# Altium project zxRevo rev2.5.PrjPcb (part 1 of 3)
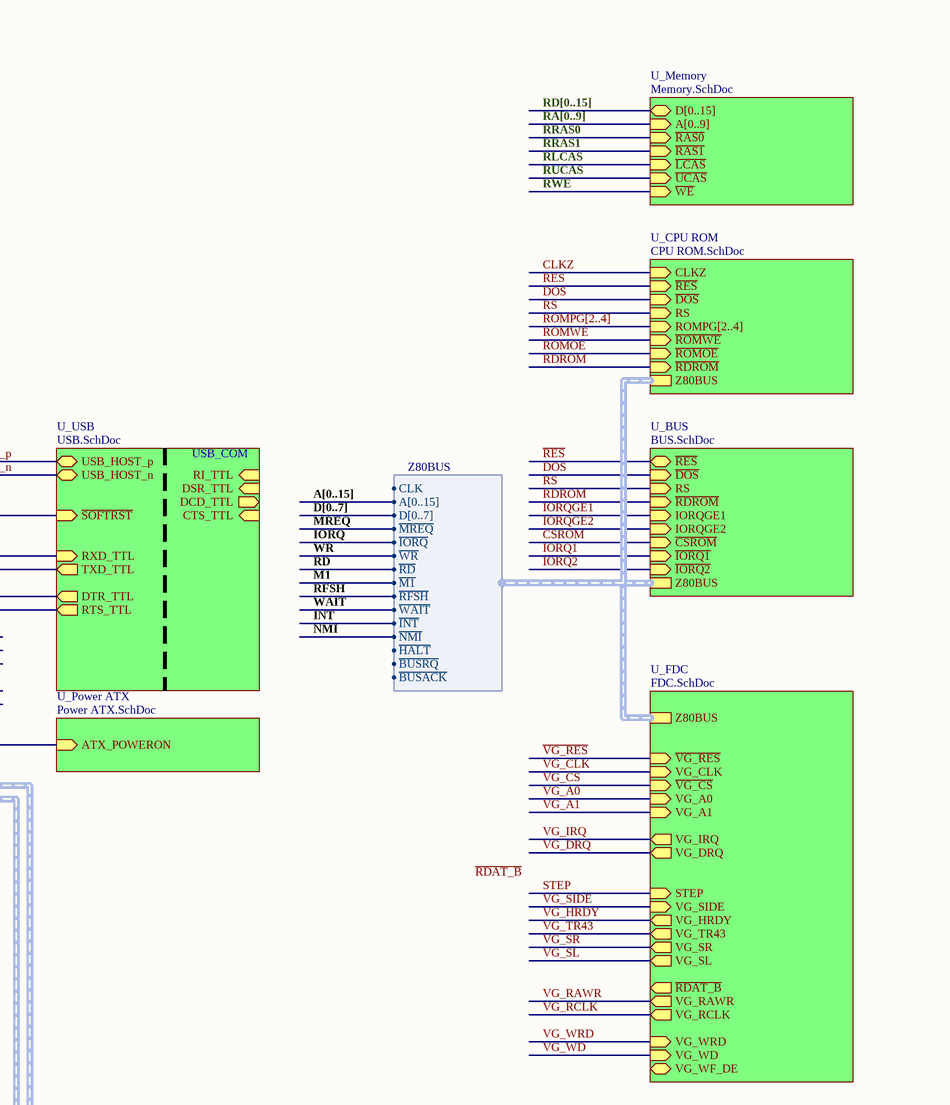
[diagram p0: TOP.SchDoc, top right]
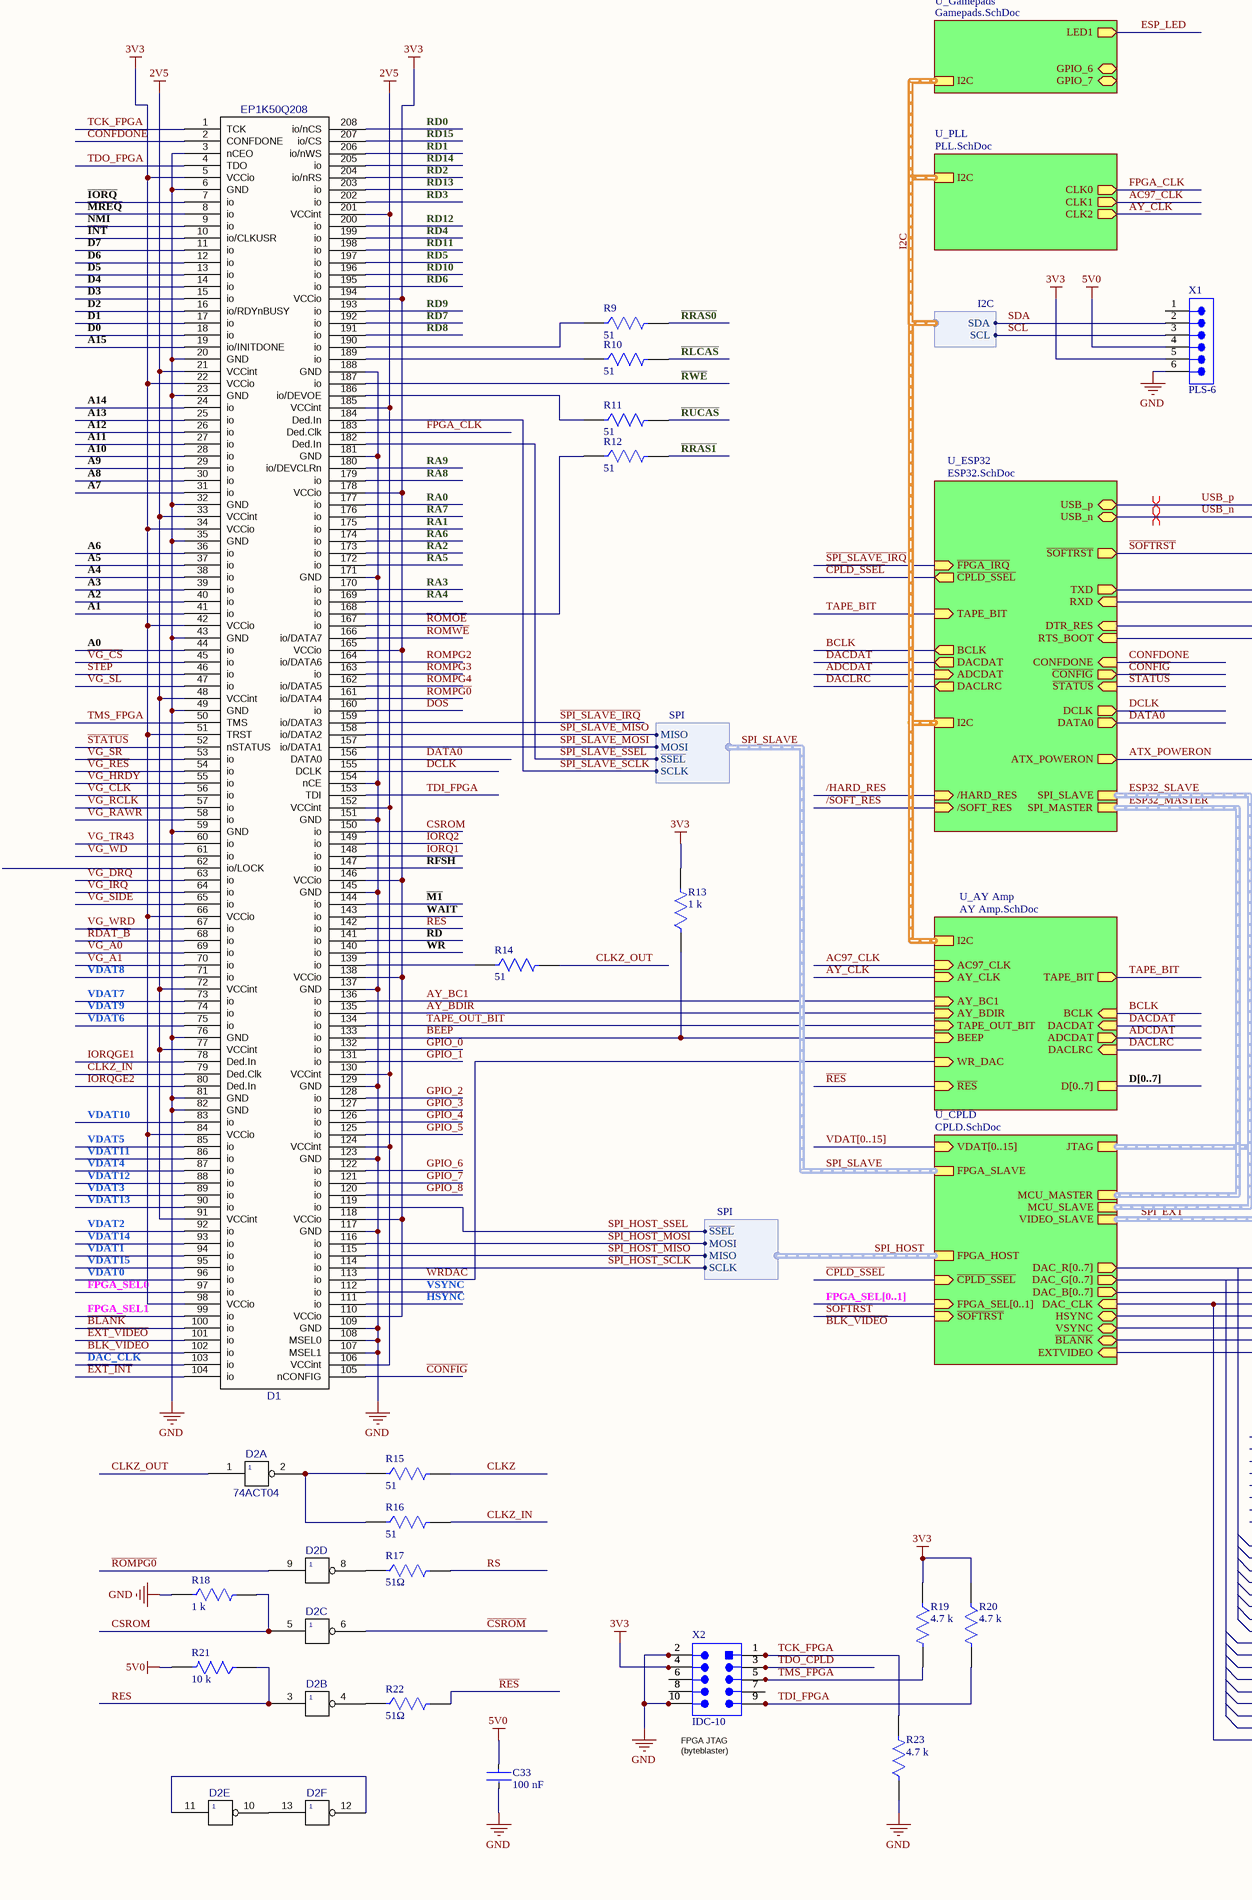
[diagram p1: TOP.SchDoc, bottom left]
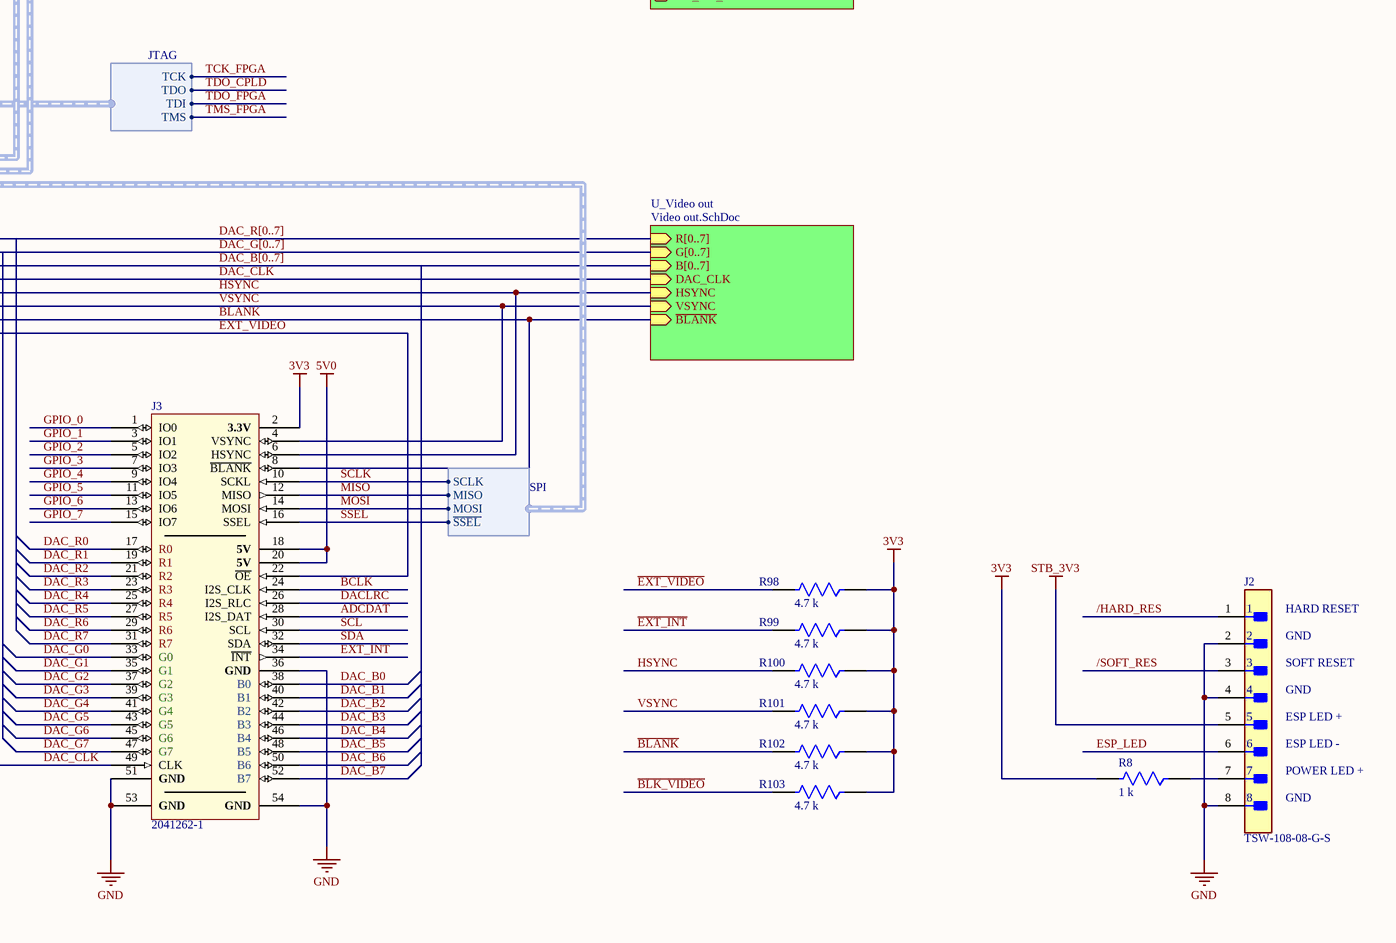
[diagram p2: TOP.SchDoc, bottom right]
16 sheets, 318 parts. Net scope: hierarchical (ports join the sheet entries above them; power ports are global).
Board file: RevA2.PcbDoc
Sheets:
  TOP.SchDoc
    U_Memory = Memory.SchDoc
    U_CPU ROM = CPU ROM.SchDoc
    U_BUS = BUS.SchDoc
    U_FDC = FDC.SchDoc
    U_CPLD = CPLD.SchDoc
      U_SDCARD = SDCARD.SchDoc
    U_Power ATX = Power ATX.SchDoc
    U_USB = USB.SchDoc
    U_ESP32 = ESP32.SchDoc
    U_AY Amp = AY Amp.SchDoc
      U_Tape = Tape.SchDoc
    U_PLL = PLL.SchDoc
    U_Gamepads = Gamepads.SchDoc
    U_Video out = Video out.SchDoc
  Sheet1.SchDoc

## Sheet TOP.SchDoc
size A1; SheetNumber: 1; SheetTotal: 16

### Parts
C33  Capacitance: 100 nF  [CC0805]  (hidden comment: CC0805-1.5pF)
D1  EP1K50Q208  [PQFP208X5]
D2  value 74ACT04  [SO14]  (hidden comment: 04)  (parts A,B,C,D,E,F of 6)
J2  TSW-108-08-G-S  [FP-TSW-108-08-G-S-MFG]
J3  2041262-1  [FP-2041262-1-0]
R8  Resistance: 1 k  [CR0805]  (hidden comment: CR0805-51)
R9  Resistance: 51  [CR0805]  (hidden comment: CR0805-51)
R10  Resistance: 51  [CR0805]  (hidden comment: CR0805-51)
R11  Resistance: 51  [CR0805]  (hidden comment: CR0805-51)
R12  Resistance: 51  [CR0805]  (hidden comment: CR0805-51)
R13  Resistance: 1 k  [CR0805]  (hidden comment: CR0805-51)
R14  Resistance: 51  [CR0805]  (hidden comment: CR0805-51)
R15  Resistance: 51  [CR0805]  (hidden comment: CR0805-51)
R16  Resistance: 51  [CR0805]  (hidden comment: CR0805-51)
R17  value 51Ω  [CR0805]  (hidden comment: CR0805-51)
R18  Resistance: 1 k  [CR0805]  (hidden comment: CR0805-51)
R19  Resistance: 4.7 k  [CR0805]  (hidden comment: CR0805-51)
R20  Resistance: 4.7 k  [CR0805]  (hidden comment: CR0805-51)
R21  Resistance: 10 k  [CR0805]  (hidden comment: CR0805-51)
R22  value 51Ω  [CR0805]  (hidden comment: CR0805-51)
R23  Resistance: 4.7 k  [CR0805]  (hidden comment: CR0805-51)
R98  Resistance: 4.7 k  [CR0805]  (hidden comment: CR0805-51)
R99  Resistance: 4.7 k  [CR0805]  (hidden comment: CR0805-51)
R100  Resistance: 4.7 k  [CR0805]  (hidden comment: CR0805-51)
R101  Resistance: 4.7 k  [CR0805]  (hidden comment: CR0805-51)
R102  Resistance: 4.7 k  [CR0805]  (hidden comment: CR0805-51)
R103  Resistance: 4.7 k  [CR0805]  (hidden comment: CR0805-51)
X1  PLS-6  [SMTC-TSW-106-07-X-S]
X2  IDC-10  [BH-10]

### Sub-sheets
U_AY Amp = AY Amp.SchDoc: AY_BC1 (in), ~{RES} (in), AY_CLK (in), AY_BDIR (in), I2C (harness I2C), DACDAT (in), TAPE_BIT (out), ADCDAT (out), BCLK (in), BEEP (in), DACLRC (in), WR_DAC (in), D[0..7], AC97_CLK (in), TAPE_OUT_BIT (in)
U_BUS = BUS.SchDoc: ~{RES} (bidir), ~{DOS} (in), RS (in), ~{RDROM} (in), IORQGE1 (in), IORQGE2 (in), ~{CSROM} (in), ~{IORQ1} (in), ~{IORQ2} (in), Z80BUS (harness Z80BUS)
U_CPLD = CPLD.SchDoc: VDAT[0..15] (in), VSYNC (bidir), HSYNC (bidir), DAC_CLK (in), FPGA_HOST (harness SPI), FPGA_SLAVE (harness SPI), MCU_MASTER (harness JTAG), MCU_SLAVE (harness SPI), FPGA_SEL[0..1] (in), JTAG (harness JTAG), ~{SOFTRST} (in), ~{CPLD_SSEL} (in), DAC_G[0..7] (out), DAC_B[0..7] (out), DAC_R[0..7] (out), EXTVIDEO (in), ~{BLANK} (bidir), VIDEO_SLAVE (harness SPI)
U_CPU ROM = CPU ROM.SchDoc: CLKZ (in), ~{RES} (in), ~{DOS} (in), RS (in), ROMPG[2..4] (in), ~{ROMWE} (in), ~{ROMOE} (in), ~{RDROM} (in), Z80BUS (harness Z80BUS)
U_ESP32 = ESP32.SchDoc: SPI_SLAVE (harness SPI), TXD (out), RXD (in), DTR_RES (in), RTS_BOOT (in), I2C (harness I2C), TAPE_BIT (in), USB_n (bidir), USB_p (bidir), SPI_MASTER (harness SPI), ~{SOFTRST} (out), ATX_POWERON (out), ~{FPGA_IRQ} (in), DCLK (out), DATA0 (out), ~{STATUS} (in), CONFDONE (in), ~{CONFIG} (out), ~{CPLD_SSEL} (out), DACLRC (out), ADCDAT (in), BCLK (out), DACDAT (out), /HARD_RES (in), /SOFT_RES (in)
U_FDC = FDC.SchDoc: VG_CLK (in), VG_IRQ (out), VG_DRQ (out), ~{VG_CS} (in), VG_SIDE (in), STEP (in), VG_A0 (in), VG_A1 (in), VG_TR43 (out), VG_SR (out), VG_SL (out), VG_WD (in), VG_WRD (in), VG_WF_DE (bidir), VG_RAWR (out), VG_RCLK (out), ~{VG_RES} (in), VG_HRDY (out), Z80BUS (harness Z80BUS), ~{RDAT_B} (out)
U_Gamepads = Gamepads.SchDoc: GPIO_7 (bidir), LED1 (out), GPIO_6 (bidir), I2C (harness I2C)
U_Memory = Memory.SchDoc: D[0..15] (bidir), A[0..9] (in), ~{RAS0} (in), ~{RAS1} (in), ~{LCAS} (in), ~{UCAS} (in), ~{WE} (in)
U_PLL = PLL.SchDoc: CLK0 (out), CLK1 (out), CLK2 (out), I2C (harness I2C)
U_Power ATX = Power ATX.SchDoc: ATX_POWERON (in)
U_USB = USB.SchDoc: RXD_TTL (in), USB_HOST_p (bidir), TXD_TTL (out), RTS_TTL (out), CTS_TTL (in), DCD_TTL (out), DSR_TTL (in), USB_HOST_n (bidir), RI_TTL (in), DTR_TTL (out), ~{SOFTRST} (in)
U_Video out = Video out.SchDoc: R[0..7] (in), G[0..7] (in), B[0..7] (in), DAC_CLK (in), HSYNC (in), VSYNC (in), ~{BLANK} (in)

### Harnesses
SPI: ~{SSEL}, SCLK, MOSI, MISO
JTAG: TCK, TDO, TDI, TMS
I2C: SDA, SCL
Z80BUS: A[0..15], D[0..7], ~{MREQ}, ~{IORQ}, ~{WR}, ~{RD}, ~{M1}, ~{RFSH}, ~{WAIT}, ~{INT}, ~{NMI}, ~{HALT}, ~{BUSRQ}, ~{BUSACK}, CLK

### Nets
2V5: D1.21(VCCint) D1.33(VCCint) D1.48(VCCint) D1.72(VCCint) D1.77(VCCint) D1.91(VCCint) D1.106(VCCint) D1.124(VCCint) D1.130(VCCint) D1.152(VCCint) D1.185(VCCint) D1.201(VCCint)
3V3: D1.5(VCCio) D1.22(VCCio) D1.34(VCCio) D1.42(VCCio) D1.51(TRST) D1.66(VCCio) D1.84(VCCio) D1.98(VCCio) D1.110(VCCio) D1.118(VCCio) D1.138(VCCio) D1.146(VCCio) D1.165(VCCio) D1.178(VCCio) D1.194(VCCio) J3.2(3.3V) R8.2 R13.2 R19.1 R20.1 R98.1 R99.1 R100.1 R101.1 R102.1 R103.1 X1.5 X2.4
5V0: C33.1 D2.14(+5v) J3.18(5V) J3.20(5V) R21.2 X1.4  [also labelled VCC5]
GND: C33.2 D1.3(nCEO) D1.6(GND) D1.20(GND) D1.23(GND) D1.32(GND) D1.35(GND) D1.43(GND) D1.49(GND) D1.59(GND) D1.76(GND) D1.81(GND) D1.82(GND) D1.107(MSEL1) D1.108(MSEL0) D1.109(GND) D1.117(GND) D1.123(GND) D1.129(GND) D1.137(GND) D1.145(GND) D1.151(GND) D1.154(nCE) D1.171(GND) D1.181(GND) D1.188(GND) D2.7(GND) J2.2 J2.4 J2.8 J3.36(GND) J3.51(GND) J3.53(GND) J3.54(GND) R18.1 R23.1 X1.6 X2.2 X2.10
STB_3V3: J2.5
/HARD_RES: J2.1 ; sheet U_ESP32//HARD_RES
/SOFT_RES: J2.3 ; sheet U_ESP32//SOFT_RES
A0: D1.44(io)
A1: D1.41(io)
A2: D1.40(io)
A3: D1.39(io)
A4: D1.38(io)
A5: D1.37(io)
A6: D1.36(io)
A7: D1.31(io)
A8: D1.30(io)
A9: D1.29(io)
A10: D1.28(io)
A11: D1.27(io)
A12: D1.26(io)
A13: D1.25(io)
A14: D1.24(io)
A15: D1.19(io/INITDONE)
AC97_CLK: sheet U_AY Amp/AC97_CLK, sheet U_PLL/CLK1
ADCDAT: J3.28(I2S_DAT) ; sheet U_ESP32/ADCDAT, sheet U_AY Amp/ADCDAT
ATX_POWERON: sheet U_Power ATX/ATX_POWERON, sheet U_ESP32/ATX_POWERON
AY_BC1: D1.136(io) ; sheet U_AY Amp/AY_BC1
AY_BDIR: D1.135(io) ; sheet U_AY Amp/AY_BDIR
AY_CLK: sheet U_AY Amp/AY_CLK, sheet U_PLL/CLK2
~{BLANK}: D1.100(io) J3.8(~{BLANK}) R102.2 ; sheet U_CPLD/~{BLANK}, sheet U_Video out/~{BLANK}
~{BLK_VIDEO}: D1.102(io) R103.2  [project net ~{BLK_VIDEO}_1]
BCLK: J3.24(I2S_CLK) ; sheet U_ESP32/BCLK, sheet U_AY Amp/BCLK
BEEP: D1.133(io) R13.1 ; sheet U_AY Amp/BEEP
~{CONFIG}: D1.105(nCONFIG) ; sheet U_ESP32/~{CONFIG}
~{CPLD_SSEL}: sheet U_CPLD/~{CPLD_SSEL}, sheet U_ESP32/~{CPLD_SSEL}
~{CSROM}: D2.6 ; sheet U_BUS/~{CSROM}
CLKZ: R15.2 ; sheet U_CPU ROM/CLKZ
CLKZ_IN: D1.79(Ded.Clk) R16.2  [project net CLKZ_IN_1]
CLKZ_OUT: D2.1 R14.2  [project net CLKZ_OUT_1]
CONFDONE: D1.2(CONFDONE) ; sheet U_ESP32/CONFDONE
CSROM: D1.150(io) D2.5 R18.2  [project net CSROM_1]
D0: D1.18(io)
D1: D1.17(io)
D2: D1.16(io/RDYnBUSY)
D3: D1.15(io)
D4: D1.14(io)
D5: D1.13(io)
D6: D1.12(io)
D7: D1.11(io)
~{DOS}: D1.160(io) ; sheet U_CPU ROM/~{DOS}, sheet U_BUS/~{DOS}
DAC_B0: J3.38(B0)
DAC_B1: J3.40(B1)
DAC_B2: J3.42(B2)
DAC_B3: J3.44(B3)
DAC_B4: J3.46(B4)
DAC_B5: J3.48(B5)
DAC_B6: J3.50(B6)
DAC_B7: J3.52(B7)
DAC_CLK: D1.103(io) J3.49(CLK) ; sheet U_CPLD/DAC_CLK, sheet U_Video out/DAC_CLK
DAC_G0: J3.33(G0)
DAC_G1: J3.35(G1)
DAC_G2: J3.37(G2)
DAC_G3: J3.39(G3)
DAC_G4: J3.41(G4)
DAC_G5: J3.43(G5)
DAC_G6: J3.45(G6)
DAC_G7: J3.47(G7)
DAC_R0: J3.17(R0)
DAC_R1: J3.19(R1)
DAC_R2: J3.21(R2)
DAC_R3: J3.23(R3)
DAC_R4: J3.25(R4)
DAC_R5: J3.27(R5)
DAC_R6: J3.29(R6)
DAC_R7: J3.31(R7)
DACDAT: sheet U_ESP32/DACDAT, sheet U_AY Amp/DACDAT
DACLRC: J3.26(I2S_RLC) ; sheet U_ESP32/DACLRC, sheet U_AY Amp/DACLRC
DATA0: D1.156(DATA0) ; sheet U_ESP32/DATA0
DCLK: D1.155(DCLK) ; sheet U_ESP32/DCLK
DTR: sheet U_USB/DTR_TTL, sheet U_ESP32/DTR_RES
~{EXT_INT}: D1.104(io) J3.34(~{INT}) R99.2  [project net ~{EXT_INT}_1]
~{EXT_VIDEO}: D1.101(io) J3.22(~{OE}) R98.2 ; sheet U_CPLD/EXTVIDEO
ESP32_RXD: sheet U_USB/TXD_TTL, sheet U_ESP32/RXD
ESP32_TXD: sheet U_USB/RXD_TTL, sheet U_ESP32/TXD
ESP_LED: J2.6 ; sheet U_Gamepads/LED1
FPGA_CLK: D1.183(Ded.Clk) ; sheet U_PLL/CLK0
FPGA_SEL0: D1.97(io)
FPGA_SEL1: D1.99(io)
GPIO_0: D1.132(io) J3.1(IO0)  [project net GPIO_0_1]
GPIO_1: D1.131(io) J3.3(IO1)  [project net GPIO_1_1]
GPIO_2: D1.128(io) J3.5(IO2)  [project net GPIO_2_1]
GPIO_3: D1.127(io) J3.7(IO3)  [project net GPIO_3_1]
GPIO_4: D1.126(io) J3.9(IO4)  [project net GPIO_4_1]
GPIO_5: D1.125(io) J3.11(IO5)  [project net GPIO_5_1]
GPIO_6: D1.122(io) J3.13(IO6)  [project net GPIO_6_1]
GPIO_7: D1.121(io) J3.15(IO7)  [project net GPIO_7_1]
GPIO_8: D1.120(io)  [project net GPIO_8_1]
HSYNC: D1.111(io) J3.6(HSYNC) R100.2 ; sheet U_CPLD/HSYNC, sheet U_Video out/HSYNC
~{INT}: D1.10(io/CLKUSR) ; sheet U_CPU ROM/Z80BUS.~{INT}
~{IORQ}: D1.7(io) ; sheet U_CPU ROM/Z80BUS.~{IORQ}
~{IORQ1}: D1.148(io) ; sheet U_BUS/~{IORQ1}
~{IORQ2}: D1.149(io) ; sheet U_BUS/~{IORQ2}
IORQGE1: D1.78(Ded.In) ; sheet U_BUS/IORQGE1
IORQGE2: D1.80(Ded.In) ; sheet U_BUS/IORQGE2
~{M1}: D1.144(io) ; sheet U_CPU ROM/Z80BUS.~{M1}
~{MREQ}: D1.8(io) ; sheet U_CPU ROM/Z80BUS.~{MREQ}
MISO: J3.12(MISO) ; sheet U_CPLD/VIDEO_SLAVE.MISO
MOSI: J3.14(MOSI) ; sheet U_CPLD/VIDEO_SLAVE.MOSI
~{NMI}: D1.9(io) ; sheet U_CPU ROM/Z80BUS.~{NMI}
~{RD}: D1.141(io) ; sheet U_CPU ROM/Z80BUS.~{RD}
~{RDAT_B}: D1.68(io)  [project net ~{RDAT_B}_1]
~{RDROM}: sheet U_CPU ROM/~{RDROM}, sheet U_BUS/~{RDROM}
~{RES}: R22.2 ; sheet U_CPU ROM/~{RES}, sheet U_BUS/~{RES}, sheet U_AY Amp/~{RES}
~{RFSH}: D1.147(io) ; sheet U_CPU ROM/Z80BUS.~{RFSH}
~{RLCAS}: R10.2 ; sheet U_Memory/~{LCAS}
~{ROMOE}: D1.167(io) ; sheet U_CPU ROM/~{ROMOE}
~{ROMPG0}: D1.161(io/DATA4) D2.9  [project net ~{ROMPG0}_1]
~{ROMWE}: D1.166(io/DATA7) ; sheet U_CPU ROM/~{ROMWE}
~{RRAS0}: R9.2 ; sheet U_Memory/~{RAS0}
~{RRAS1}: R12.2 ; sheet U_Memory/~{RAS1}
~{RUCAS}: R11.2 ; sheet U_Memory/~{UCAS}
~{RWE}: D1.187(io) ; sheet U_Memory/~{WE}
RA0: D1.177(io)
RA1: D1.175(io)
RA2: D1.173(io)
RA3: D1.170(io)
RA4: D1.169(io)
RA5: D1.172(io)
RA6: D1.174(io)
RA7: D1.176(io)
RA8: D1.179(io)
RA9: D1.180(io/DEVCLRn)
RD0: D1.208(io/nCS)
RD1: D1.206(io/nWS)
RD2: D1.204(io/nRS)
RD3: D1.202(io)
RD4: D1.199(io)
RD5: D1.197(io)
RD6: D1.195(io)
RD7: D1.192(io)
RD8: D1.191(io)
RD9: D1.193(io)
RD10: D1.196(io)
RD11: D1.198(io)
RD12: D1.200(io)
RD13: D1.203(io)
RD14: D1.205(io)
RD15: D1.207(io/CS)
RES: D1.142(io) D2.3 R21.1  [project net RES_1]
ROMPG2: D1.164(io/DATA6)
ROMPG3: D1.163(io)
ROMPG4: D1.162(io/DATA5)
RS: R17.2 ; sheet U_CPU ROM/RS, sheet U_BUS/RS
RTS: sheet U_USB/RTS_TTL, sheet U_ESP32/RTS_BOOT
~{SOFTRST}: sheet U_CPLD/~{SOFTRST}, sheet U_USB/~{SOFTRST}, sheet U_ESP32/~{SOFTRST}
~{SPI_SLAVE_IRQ}: D1.159(io/DATA3) ; sheet U_ESP32/~{FPGA_IRQ}
~{SPI_SLAVE_SSEL}: D1.182(Ded.In) ; sheet U_CPLD/FPGA_SLAVE.~{SSEL}
~{STATUS}: D1.52(nSTATUS) ; sheet U_ESP32/~{STATUS}
SCL: J3.30(SCL) X1.3 ; sheet U_ESP32/I2C.SCL  [project net I2C.SCL]
SCLK: J3.10(SCKL) ; sheet U_CPLD/VIDEO_SLAVE.SCLK
SDA: J3.32(SDA) X1.2 ; sheet U_ESP32/I2C.SDA  [project net I2C.SDA]
SPI_HOST_MISO: D1.115(io) ; sheet U_CPLD/FPGA_HOST.MISO  [project net SPI_HOST.MISO]
SPI_HOST_MOSI: D1.116(io) ; sheet U_CPLD/FPGA_HOST.MOSI  [project net SPI_HOST.MOSI]
SPI_HOST_SCLK: D1.114(io) ; sheet U_CPLD/FPGA_HOST.SCLK  [project net SPI_HOST.SCLK]
SPI_HOST_SSEL: D1.119(io) ; sheet U_CPLD/FPGA_HOST.~{SSEL}  [project net SPI_HOST.~{SSEL}]
SPI_SLAVE_MISO: D1.158(io/DATA2) ; sheet U_CPLD/FPGA_SLAVE.MISO  [project net SPI_SLAVE.MISO]
SPI_SLAVE_MOSI: D1.157(io/DATA1) ; sheet U_CPLD/FPGA_SLAVE.MOSI  [project net SPI_SLAVE.MOSI]
SPI_SLAVE_SCLK: D1.184(Ded.In) ; sheet U_CPLD/FPGA_SLAVE.SCLK  [project net SPI_SLAVE.SCLK]
SSEL: J3.16(SSEL) ; sheet U_CPLD/VIDEO_SLAVE.~{SSEL}  [project net SPI_EXT.~{SSEL}]
STEP: D1.46(io) ; sheet U_FDC/STEP
TAPE_BIT: sheet U_ESP32/TAPE_BIT, sheet U_AY Amp/TAPE_BIT
TAPE_OUT_BIT: D1.134(io) ; sheet U_AY Amp/TAPE_OUT_BIT
TCK_FPGA: D1.1(TCK) R23.2 X2.1 ; sheet U_CPLD/JTAG.TCK
TDI_FPGA: D1.153(TDI) R20.2 X2.9  [project net TDI_FPGA_1]
TDO_CPLD: X2.3 ; sheet U_CPLD/JTAG.TDO
TDO_FPGA: D1.4(TDO) ; sheet U_CPLD/JTAG.TDI
TMS_FPGA: D1.50(TMS) R19.2 X2.5 ; sheet U_CPLD/JTAG.TMS
USB_n: sheet U_USB/USB_HOST_n, sheet U_ESP32/USB_n
USB_p: sheet U_USB/USB_HOST_p, sheet U_ESP32/USB_p
~{VG_CS}: D1.45(io) ; sheet U_FDC/~{VG_CS}
~{VG_RES}: D1.54(io) ; sheet U_FDC/~{VG_RES}
VDAT0: D1.96(io)
VDAT1: D1.94(io)
VDAT2: D1.92(io)
VDAT3: D1.89(io)
VDAT4: D1.87(io)
VDAT5: D1.85(io)
VDAT6: D1.75(io)
VDAT7: D1.73(io)
VDAT8: D1.71(io)
VDAT9: D1.74(io)
VDAT10: D1.83(io)
VDAT11: D1.86(io)
VDAT12: D1.88(io)
VDAT13: D1.90(io)
VDAT14: D1.93(io)
VDAT15: D1.95(io)
VG_A0: D1.69(io) ; sheet U_FDC/VG_A0
VG_A1: D1.70(io) ; sheet U_FDC/VG_A1
VG_CLK: D1.56(io) ; sheet U_FDC/VG_CLK
VG_DRQ: D1.63(io) ; sheet U_FDC/VG_DRQ
VG_HRDY: D1.55(io) ; sheet U_FDC/VG_HRDY
VG_IRQ: D1.64(io) ; sheet U_FDC/VG_IRQ
VG_RAWR: D1.58(io) ; sheet U_FDC/VG_RAWR
VG_RCLK: D1.57(io) ; sheet U_FDC/VG_RCLK
VG_SIDE: D1.65(io) ; sheet U_FDC/VG_SIDE
VG_SL: D1.47(io) ; sheet U_FDC/VG_SL
VG_SR: D1.53(io) ; sheet U_FDC/VG_SR
VG_TR43: D1.60(io) ; sheet U_FDC/VG_TR43
VG_WD: D1.61(io) ; sheet U_FDC/VG_WD
VG_WRD: D1.67(io) ; sheet U_FDC/VG_WRD
VSYNC: D1.112(io) J3.4(VSYNC) R101.2 ; sheet U_CPLD/VSYNC, sheet U_Video out/VSYNC
~{WAIT}: D1.143(io) ; sheet U_CPU ROM/Z80BUS.~{WAIT}
~{WR}: D1.140(io) ; sheet U_CPU ROM/Z80BUS.~{WR}
WRDAC: D1.113(io) ; sheet U_AY Amp/WR_DAC
NetD1_139: D1.139(io) R14.1
NetD1_168: D1.168(io) R12.1
NetD1_186: D1.186(io/DEVOE) R11.1
NetD1_189: D1.189(io) R10.1
NetD1_190: D1.190(io) R9.1
NetD2_2: D2.2 R15.1 R16.1
NetD2_4: D2.4 R22.1
NetD2_8: D2.8 R17.1
NetD2_10: D2.10 D2.13
NetD2_11: D2.11 D2.12
NetJ2_7: J2.7 R8.1

Not connected (* = marked no-connect by the designer): D1 62(io/LOCK); X1 1; X2 6 7 8

### Buses and harness runs
bus A[0..15]
bus D[0..7]
bus D[0..7] = sheet U_AY Amp/D[0..7]
bus DAC_B[0..7] = sheet U_CPLD/DAC_B[0..7] = sheet U_Video out/B[0..7]
bus DAC_G[0..7] = sheet U_CPLD/DAC_G[0..7] = sheet U_Video out/G[0..7]
bus DAC_R[0..7] = sheet U_CPLD/DAC_R[0..7] = sheet U_Video out/R[0..7]
bus FPGA_SEL[0..1] = sheet U_CPLD/FPGA_SEL[0..1]
bus RA[0..9] = sheet U_Memory/A[0..9]
bus RD[0..15] = sheet U_Memory/D[0..15]
bus ROMPG[2..4] = sheet U_CPU ROM/ROMPG[2..4]
bus VDAT[0..15] = sheet U_CPLD/VDAT[0..15]
harness ESP32_MASTER = sheet U_CPLD/MCU_MASTER = sheet U_ESP32/SPI_MASTER
harness ESP32_SLAVE = sheet U_CPLD/MCU_SLAVE = sheet U_ESP32/SPI_SLAVE
harness I2C = sheet U_AY Amp/I2C = sheet U_ESP32/I2C = sheet U_Gamepads/I2C = sheet U_PLL/I2C
harness sheet U_BUS/Z80BUS = sheet U_CPU ROM/Z80BUS = sheet U_FDC/Z80BUS
harness SPI_EXT = sheet U_CPLD/VIDEO_SLAVE
harness SPI_HOST = sheet U_CPLD/FPGA_HOST
harness SPI_SLAVE = sheet U_CPLD/FPGA_SLAVE

### Layout directives
differential pair: USB_n, USB_p

### Notes on the sheet
- USB_COM
- (near J2) HARD RESET
- (near J2) SOFT RESET
- (near J2) GND
- (near J2) ESP LED +
- (near J2) ESP LED -
- (near X2) FPGA JTAG
  (byteblaster)
- (near J2) POWER LED +
- Labels drawn without touching a wire or pin: ~{BLK_VIDEO}, ~{RDAT_B}

### Library data of the parts
C33 = CC0805: CL21 Series 0805 1.5pF 50V ±0.25pF Tolerance C0G Multilayer Ceramic Chip Capacitor; Manufacturer Part Number: CL21C1R5CBANNNC; Manufacturer: Samsung; value: 1.5pF; Category: Cap; Case/Package: 0805
J2 = CMP-02766-000001-1: CONN HEADER VERT 8POS 2.54MM; Manufacturer: Samtec; Number Of Contacts: 8; Conn Orientation: Straight; Conn Gender: Male; Device Class L1: Connectors; ComponentLink2Description: Datasheet; Digikey Description: CONN HEADER VERT 8POS 2.54MM; ComponentLink2URL: http://suddendocs.samtec.com/catalog_english/tsw_th.pdf; Temperature: -55°C to +125°C; RoHS: TRUE; Mouser Description: TSW - Samtec 2.54mm Pin Header 13.46mm Overall Pin Length 5.08mm Tail; Automotive: No; Temperature Range High: +125°C; Package: TSW-108-08-G-S; Device Class L3: unset; Manufacturer Part Number: TSW-108-08-G-S; Pitch: 2.54mm; Number Of Rows: 1; Lead Free: Yes; Height: 8.71mm; Contact Material: Gold,Nickel; Footprint Url: http://suddendocs.samtec.com/prints/tsw-xxx-xx-x-x-xx-xxx-footprint.pdf; Temperature Range Low: -55°C; Octopart: https://octopart.com/tsw-108-08-g-s-samtec-272653; Category: Conn; Device Class L2: Headers and Wire Housings
J3 = CMP-03365-000006-1: CONN PCI EXP MINI FEMALE 52POS; Manufacturer: TE Connectivity AMP; Number of Positions: 52; High Temperature Housing: Yes; PCB Mounting Orientation: Horizontal; Row Spacing: 0.031inch; Connector Type: Receptacle; Pitch: 0.8mm; PCB Mount Retention: Without; Stackable: No; Stack Height: 0.268inch; Number of Contacts: 52; Mount: Surface Mount; ELV: Compliant; Orientation: Right Angle; Flammability Rating: UL94 V-0; Number of Pins: 52; Housing Color: Black; Packaging: Tape and Reel; Contact Plating: Gold; Lead Free: Lead Free; Termination: Solder; Package Quantity: 450; Contact Material: Copper Alloy; Max Operating Temperature: 85°C; Min Operating Temperature: -55°C; Number of Rows: 2; RoHS Compliant: Yes; Housing Material: Thermoplastic; Manufacturer Part Number: 2041262-1
R8-R16 R18-R21 R23 R98-R103 = CR0805: 51Ω ±0.5% 0.1W 1/10W Chip Resistor 0805 (2012 Metric) Thin Film; Manufacturer: Susumu; Manufacturer Part Number: RR1220Q-510-D; Case/Package: 0805; Number of Terminations: 2; value: 51Ω; Category: Res; Termination: SMD/SMT; Number of Pins: 2
R17 R22 = CR0805: 51Ω ±0.5% 0.1W 1/10W Chip Resistor 0805 (2012 Metric) Thin Film; Manufacturer: Susumu; Manufacturer Part Number: RR1220Q-510-D; Resistance: 680; Category: Res; Case/Package: 0805; Number of Terminations: 2; Termination: SMD/SMT; Number of Pins: 2
X1 = CMP-1024-00383-1: 0.025" SQ Post Header, Through-hole, Vertical, -55 to 125 degC, 2.54 mm Pitch, 6-Pin, Male, RoHS; Manufacturer: Samtec; PartNumber: TSW-106-07-G-S; Pitch: 2.54 mm; value: 6 pin header 2.54mm; PackageDescription: .025[0.64] SQ. Post Terminal Strip Assembly; Manufacturer Part Number: TSW-106-07-G-S; Case/Package: PLS-6; Category: Connector
X2 = IDC-10: Male Header, Pitch 2.54 mm, 2 x 5 Postion, Height 9.91 mm, Tail Length 2.84 mm, -55 to 105 degC, RoHS, Bulk; PartNumber: N2510; Manufacturer: 3M; Manufacturer Part Number: N2510-6002RB; Pitch: 2.54mm; value: 10-Pin Shrouded Header, 2.54mm; Case/Package: IDC-10; Category: Connector
D1 = EP1K50Q208: Value: EP1K50Q208; Case/Package: PQFP-208; Category: IC
D2 = 04: Case/Package: SOIC-14; Category: IC

## Sheet Memory.SchDoc
size A4; SheetNumber: 6; SheetTotal: 15
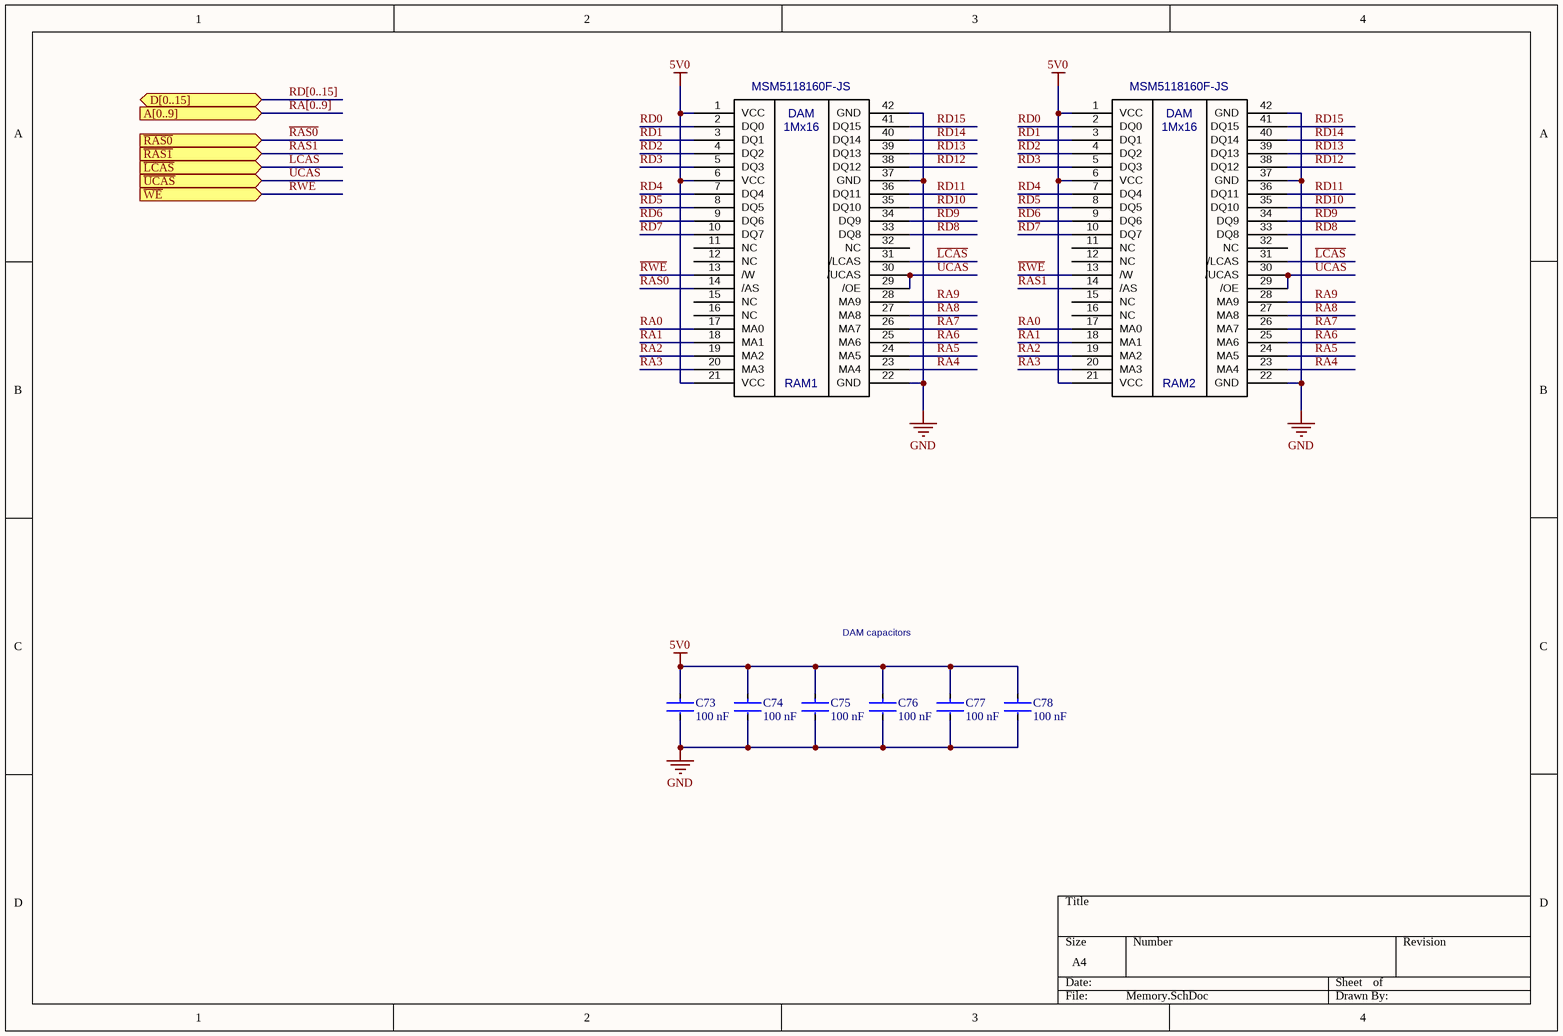
[diagram p3: Memory.SchDoc]

### Parts
C73  Capacitance: 100 nF  [CC0805]  (hidden comment: CC0805-1.5pF)
C74  Capacitance: 100 nF  [CC0805]  (hidden comment: CC0805-1.5pF)
C75  Capacitance: 100 nF  [CC0805]  (hidden comment: CC0805-1.5pF)
C76  Capacitance: 100 nF  [CC0805]  (hidden comment: CC0805-1.5pF)
C77  Capacitance: 100 nF  [CC0805]  (hidden comment: CC0805-1.5pF)
C78  Capacitance: 100 nF  [CC0805]  (hidden comment: CC0805-1.5pF)
RAM1  MSM5118160F-JS  [SOJ42]
RAM2  MSM5118160F-JS  [SOJ42]

### Ports
A[0..9] (in), D[0..15] (bidir), ~{LCAS} (in), ~{RAS0} (in), ~{RAS1} (in), ~{UCAS} (in), ~{WE} (in)

### Nets
5V0: C73.1 C74.1 C75.1 C76.1 C77.1 C78.1 RAM1.1(VCC) RAM1.6(VCC) RAM1.21(VCC) RAM2.1(VCC) RAM2.6(VCC) RAM2.21(VCC)
GND: C73.2 C74.2 C75.2 C76.2 C77.2 C78.2 RAM1.22(GND) RAM1.37(GND) RAM1.42(GND) RAM2.22(GND) RAM2.37(GND) RAM2.42(GND)
~{LCAS}: RAM1.31(/LCAS) RAM2.31(/LCAS) ; port ~{LCAS}  [project net ~{RLCAS}]
~{RAS0}: RAM1.14(/AS) ; port ~{RAS0}  [project net ~{RRAS0}]
~{RAS1}: RAM2.14(/AS) ; port ~{RAS1}  [project net ~{RRAS1}]
~{RWE}: RAM1.13(/W) RAM2.13(/W) ; port ~{WE}
RA0: RAM1.17(MA0) RAM2.17(MA0)
RA1: RAM1.18(MA1) RAM2.18(MA1)
RA2: RAM1.19(MA2) RAM2.19(MA2)
RA3: RAM1.20(MA3) RAM2.20(MA3)
RA4: RAM1.23(MA4) RAM2.23(MA4)
RA5: RAM1.24(MA5) RAM2.24(MA5)
RA6: RAM1.25(MA6) RAM2.25(MA6)
RA7: RAM1.26(MA7) RAM2.26(MA7)
RA8: RAM1.27(MA8) RAM2.27(MA8)
RA9: RAM1.28(MA9) RAM2.28(MA9)
RD0: RAM1.2(DQ0) RAM2.2(DQ0)
RD1: RAM1.3(DQ1) RAM2.3(DQ1)
RD2: RAM1.4(DQ2) RAM2.4(DQ2)
RD3: RAM1.5(DQ3) RAM2.5(DQ3)
RD4: RAM1.7(DQ4) RAM2.7(DQ4)
RD5: RAM1.8(DQ5) RAM2.8(DQ5)
RD6: RAM1.9(DQ6) RAM2.9(DQ6)
RD7: RAM1.10(DQ7) RAM2.10(DQ7)
RD8: RAM1.33(DQ8) RAM2.33(DQ8)
RD9: RAM1.34(DQ9) RAM2.34(DQ9)
RD10: RAM1.35(DQ10) RAM2.35(DQ10)
RD11: RAM1.36(DQ11) RAM2.36(DQ11)
RD12: RAM1.38(DQ12) RAM2.38(DQ12)
RD13: RAM1.39(DQ13) RAM2.39(DQ13)
RD14: RAM1.40(DQ14) RAM2.40(DQ14)
RD15: RAM1.41(DQ15) RAM2.41(DQ15)
~{UCAS}: RAM1.29(/OE) RAM1.30(/UCAS) RAM2.29(/OE) RAM2.30(/UCAS) ; port ~{UCAS}  [project net ~{RUCAS}]

Not connected (* = marked no-connect by the designer): RAM1 11(NC) 12(NC) 15(NC) 16(NC) 32(NC); RAM2 11(NC) 12(NC) 15(NC) 16(NC) 32(NC)

### Buses and harness runs
bus RA[0..9] = port A[0..9]
bus RD[0..15] = port D[0..15]

### Notes on the sheet
- DAM capacitors
- (in symbol MSM5118160F-JS) DAM; 1Mx16

### Library data of the parts
C73-C78 = CC0805: as C33 on sheet TOP; value: 1.5pF; Category: Cap; Case/Package: 0805
RAM1 RAM2 = MSM5118160F-JS: Value: MSM5118160F-JS; Case/Package: SOJ-42; Category: IC

## Sheet CPU ROM.SchDoc
size A4; SheetNumber: 9; SheetTotal: 15
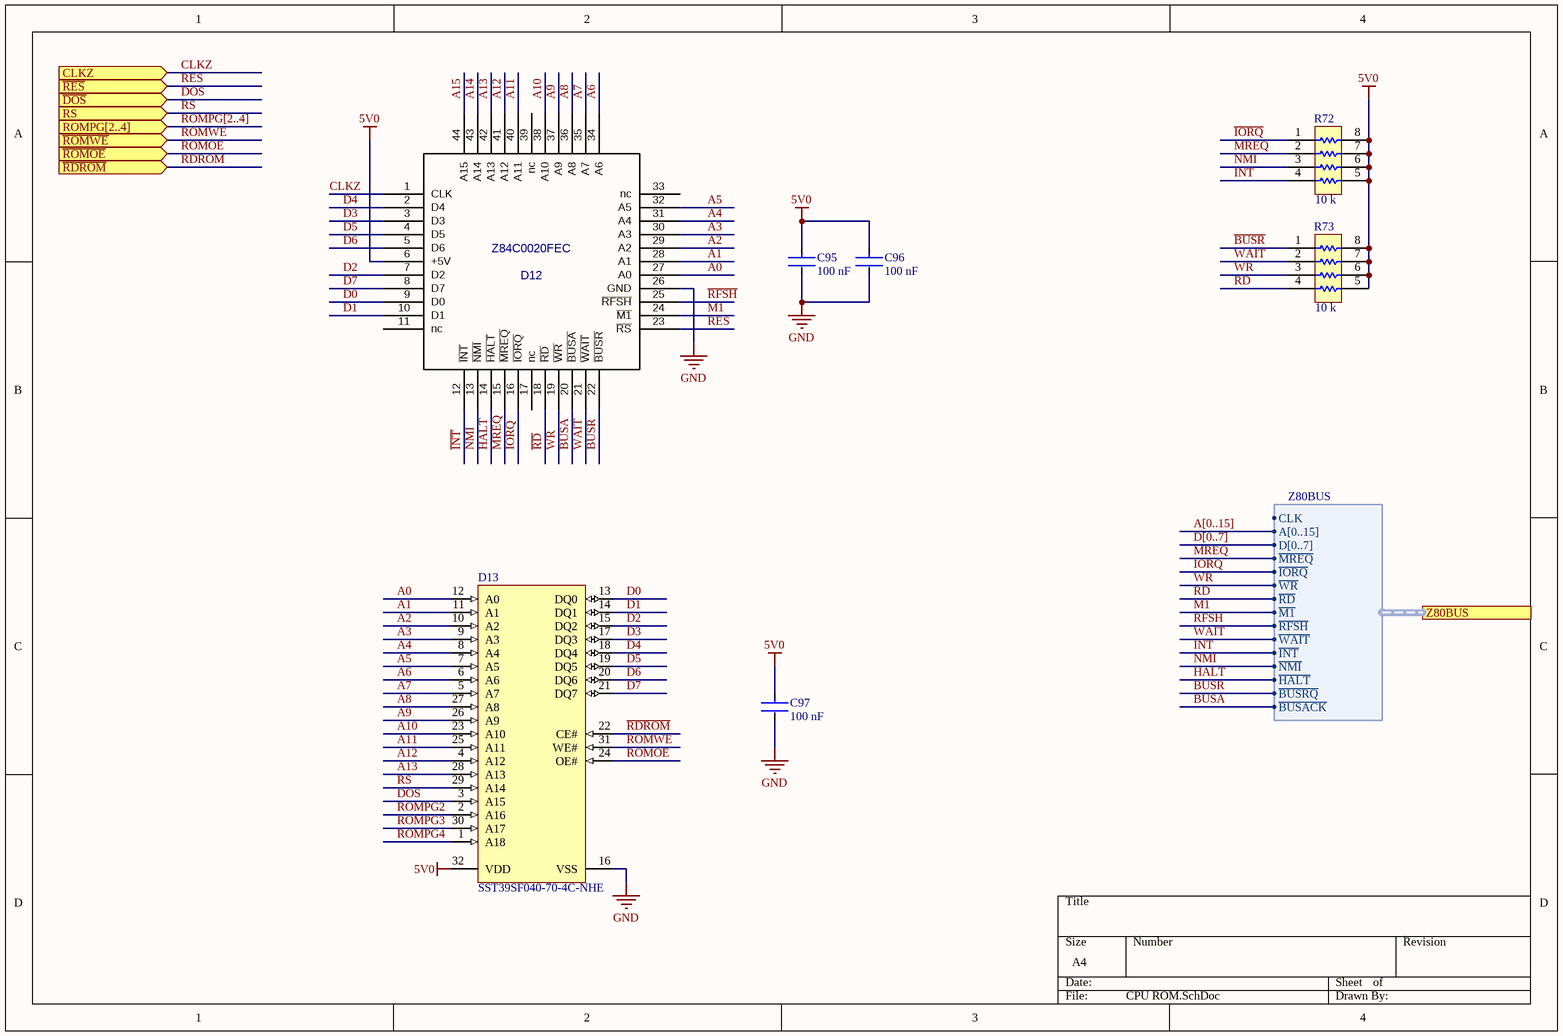
[diagram p4: CPU ROM.SchDoc]

### Parts
C95  Capacitance: 100 nF  [CC0805]  (hidden comment: CC0805-1.5pF)
C96  Capacitance: 100 nF  [CC0805]  (hidden comment: CC0805-1.5pF)
C97  Capacitance: 100 nF  [CC0805]  (hidden comment: CC0805-1.5pF)
D12  Z84C0020FEC  [QFP44X8]
D13  SST39SF040-70-4C-NHE  [MCHP-PLCC-NH32_L]
R72  Resistance: 10 k  [BOUR-CAY16-J4_V]  (hidden comment: CAY16-103J4LF)
R73  Resistance: 10 k  [BOUR-CAY16-J4_V]  (hidden comment: CAY16-103J4LF)

### Ports
CLKZ (in), ROMPG[2..4] (in), RS (in), Z80BUS (harness Z80BUS), ~{DOS} (in), ~{RDROM} (in), ~{RES} (in), ~{ROMOE} (in), ~{ROMWE} (in)

### Harnesses
Z80BUS: A[0..15], D[0..7], ~{MREQ}, ~{IORQ}, ~{WR}, ~{RD}, ~{M1}, ~{RFSH}, ~{WAIT}, ~{INT}, ~{NMI}, ~{HALT}, ~{BUSRQ}, ~{BUSACK}, CLK

### Nets
5V0: C95.1 C96.1 C97.1 D12.6(+5V) D13.32(VDD) R72.5 R72.6 R72.7 R72.8 R73.5 R73.6 R73.7 R73.8
GND: C95.2 C96.2 C97.2 D12.26(GND) D13.16(VSS)
A0: D12.27(A0) D13.12(A0)
A1: D12.28(A1) D13.11(A1)
A2: D12.29(A2) D13.10(A2)
A3: D12.30(A3) D13.9(A3)
A4: D12.31(A4) D13.8(A4)
A5: D12.32(A5) D13.7(A5)
A6: D12.34(A6) D13.6(A6)
A7: D12.35(A7) D13.5(A7)
A8: D12.36(A8) D13.27(A8)
A9: D12.37(A9) D13.26(A9)
A10: D12.38(A10) D13.23(A10)
A11: D12.40(A11) D13.25(A11)
A12: D12.41(A12) D13.4(A12)
A13: D12.42(A13) D13.28(A13)
A14: D12.43(A14)
A15: D12.44(A15)
~{BUSA}: D12.20(~{BUSA}) ; port Z80BUS.~{BUSACK}
~{BUSR}: D12.22(~{BUSR}) R73.1 ; port Z80BUS.~{BUSRQ}
CLKZ: D12.1(CLK) ; port CLKZ
D0: D12.9(D0) D13.13(DQ0)
D1: D12.10(D1) D13.14(DQ1)
D2: D12.7(D2) D13.15(DQ2)
D3: D12.3(D3) D13.17(DQ3)
D4: D12.2(D4) D13.18(DQ4)
D5: D12.4(D5) D13.19(DQ5)
D6: D12.5(D6) D13.20(DQ6)
D7: D12.8(D7) D13.21(DQ7)
~{DOS}: D13.3(A15) ; port ~{DOS}
~{HALT}: D12.14(~{HALT}) ; port Z80BUS.~{HALT}
~{INT}: D12.12(~{INT}) R72.4 ; port Z80BUS.~{INT}
~{IORQ}: D12.16(~{IORQ}) R72.1 ; port Z80BUS.~{IORQ}
~{M1}: D12.24(~{M1}) ; port Z80BUS.~{M1}
~{MREQ}: D12.15(~{MREQ}) R72.2 ; port Z80BUS.~{MREQ}
~{NMI}: D12.13(~{NMI}) R72.3 ; port Z80BUS.~{NMI}
~{RD}: D12.18(~{RD}) R73.4 ; port Z80BUS.~{RD}
~{RDROM}: D13.22(CE#) ; port ~{RDROM}
~{RES}: D12.23(~{RS}) ; port ~{RES}
~{RFSH}: D12.25(~{RFSH}) ; port Z80BUS.~{RFSH}
~{ROMOE}: D13.24(OE#) ; port ~{ROMOE}
~{ROMWE}: D13.31(WE#) ; port ~{ROMWE}
ROMPG2: D13.2(A16)
ROMPG3: D13.30(A17)
ROMPG4: D13.1(A18)
RS: D13.29(A14) ; port RS
~{WAIT}: D12.21(~{WAIT}) R73.2 ; port Z80BUS.~{WAIT}
~{WR}: D12.19(~{WR}) R73.3 ; port Z80BUS.~{WR}

Not connected (* = marked no-connect by the designer): D12 11(nc) 17(nc) 33(nc) 39(nc)

### Buses and harness runs
bus A[0..15]
bus D[0..7]
bus ROMPG[2..4] = port ROMPG[2..4]

### Library data of the parts
C95-C97 = CC0805: as C33 on sheet TOP; value: 1.5pF; Category: Cap; Case/Package: 0805
D13 = SST39SF040-70-4C-NHE: 4 Mbit Multi-Purpose Flash, 4.5 to 5.5 V, 1 kHz, 0 to 70 degC, 32-pin PLCC (NH32), Tube; Manufacturer: Microchip; PartNumber: SST39SF040-70-4C-NHE; PackageDescription: 32-lead Plastic Lead Chip Carrier, 11.43 x 13.97 mm Body, 1.27 mm Pitch; Manufacturer Part Number: SST39SF040-70-4C-NHE; value: SST39SF040-70-4C-NHE; Case/Package: PLCC-32; Category: IC
R72 R73 = CMP-1747-00005-1: Chip Resistor Array, 10 KOhm, +/- 5%, 62.5 mW, -55 to 125 degC, 8-Pin SMD, RoHS, Tape and Reel; Power Rating: 100 mW; Case\Package: 0603; Voltage Rating: 75 V; Tolerance: 1%; Packaging: Tape and Reel; Min Operating Temperature: -55 degC; Pins: 2; Radiation Hardening: No; DatasheetVersion: Jan-15; Length: 0.063 inch; RoHSCompliant: true; Mount: Surface Mount; ComponentLink1Description: Manufacturer URL; ComponentLink1URL: http://www.bourns.com/; Weight: 7.1E-05 oz; ComponentLink2URL: http://www.bourns.com/docs/Product-Datasheets/CATCAY.pdf; PackageReference: CAY16-J4; Width: 0.031 inch; Case Code (Imperial): 0603; Case Code (Metric): 1608; REACH SVHC: Yes; Max Operating Temperature: 155 degC; ComponentLink2Description: Datasheet; Height: 0.022 inch; PackageDescription: 8-Pin Surface Mount Device, Body 1.6 x 3.2 mm, Pitch 0.8 mm
D12 = Z84C0020FEC: Value: Z84C0020FEC; Case/Package: QFP-44; Category: IC

## Sheet BUS.SchDoc
size A4; SheetNumber: 8; SheetTotal: 15
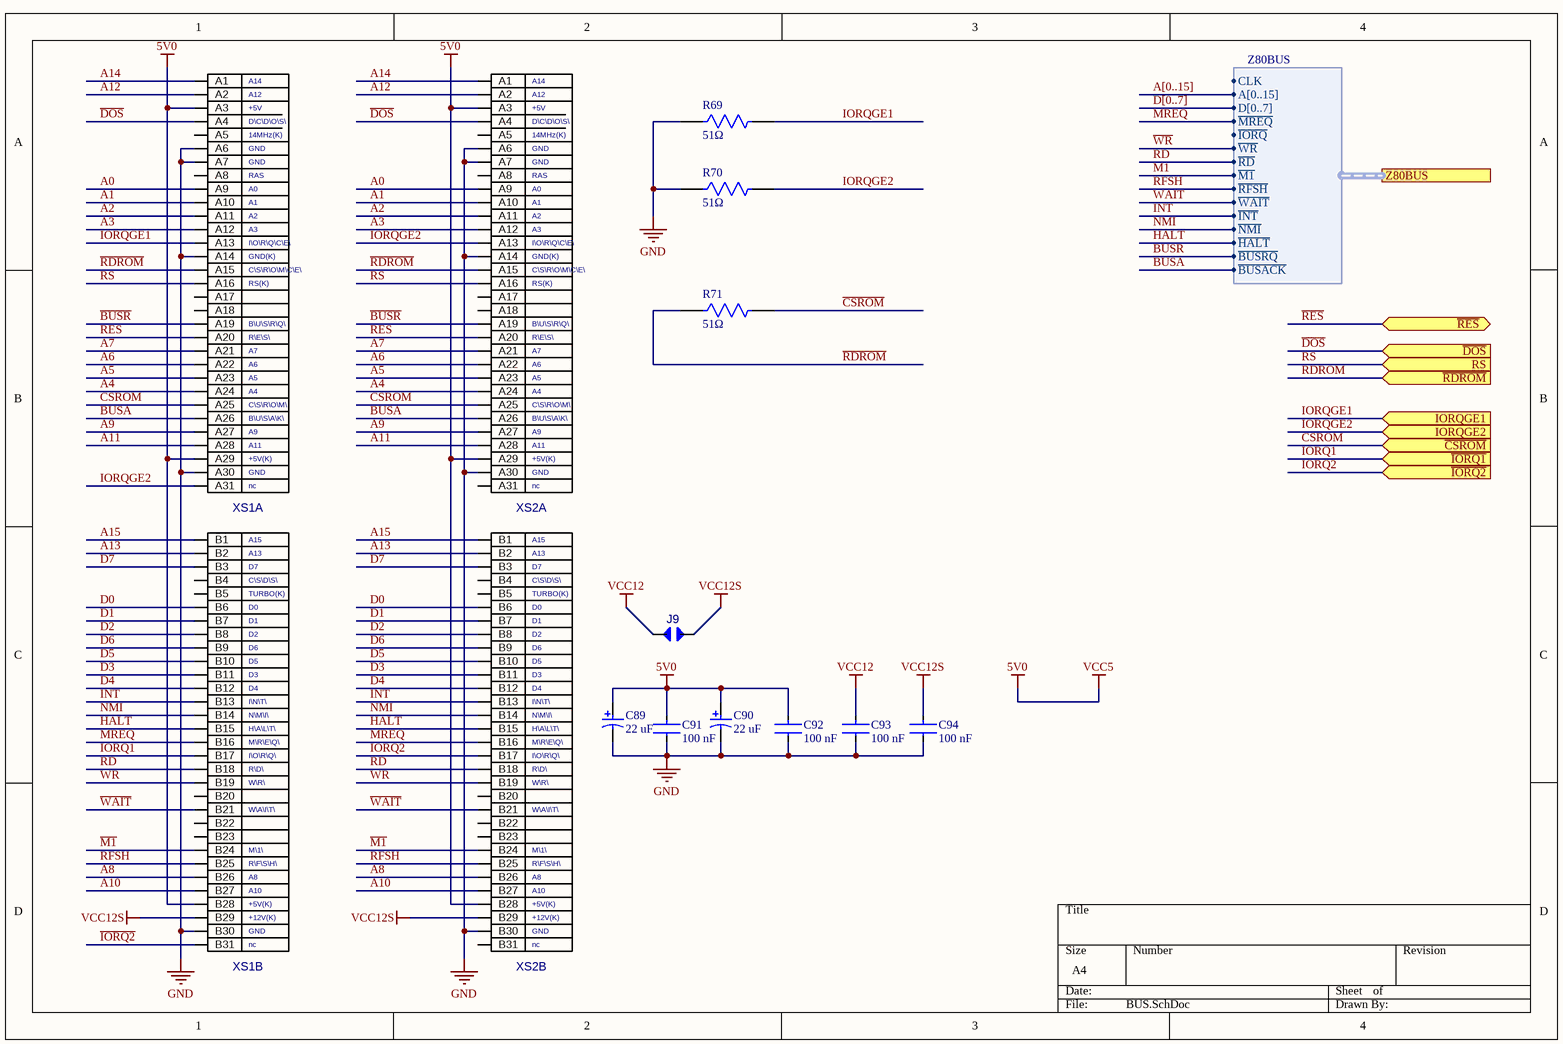
[diagram p5: BUS.SchDoc]

### Parts
C89  Capacitance: 22 uF  [AVX-TAJ-B-2_M]  (hidden comment: EC1210-22uF)
C90  Capacitance: 22 uF  [AVX-TAJ-B-2_M]  (hidden comment: EC1210-22uF)
C91  Capacitance: 100 nF  [CC0805]  (hidden comment: CC0805-1.5pF)
C92  Capacitance: 100 nF  [CC0805]  (hidden comment: CC0805-1.5pF)
C93  Capacitance: 100 nF  [CC0805]  (hidden comment: CC0805-1.5pF)
C94  Capacitance: 100 nF  [CC0805]  (hidden comment: CC0805-1.5pF)
J9  JUMPER  [JUMPER_JUMPER(Primary)]  (value not drawn)
R69  value 51Ω  [CR0805]  (hidden comment: CR0805-51)
R70  value 51Ω  [CR0805]  (hidden comment: CR0805-51)
R71  value 51Ω  [CR0805]  (hidden comment: CR0805-51)
XS1  ZXSLOT  [SLOT62_ZXSLOT(Primary)]  (value not drawn)  (parts A,B of 2)
XS2  ZXSLOT  [SLOT62_ZXSLOT(Primary)]  (value not drawn)  (parts A,B of 2)

### Ports
IORQGE1 (in), IORQGE2 (in), RS (in), Z80BUS (harness Z80BUS), ~{CSROM} (in), ~{DOS} (in), ~{IORQ1} (in), ~{IORQ2} (in), ~{RDROM} (in), ~{RES} (bidir)

### Harnesses
Z80BUS: A[0..15], D[0..7], ~{MREQ}, ~{IORQ}, ~{WR}, ~{RD}, ~{M1}, ~{RFSH}, ~{WAIT}, ~{INT}, ~{NMI}, ~{HALT}, ~{BUSRQ}, ~{BUSACK}, CLK

### Nets
5V0: C89.1 C90.1 C91.1 C92.1 XS1.A3 XS1.A29 XS1.B28 XS2.A3 XS2.A29 XS2.B28  [also labelled VCC5]
GND: C89.2 C90.2 C91.2 C92.2 C93.2 C94.2 R69.1 R70.1 XS1.A6 XS1.A7 XS1.A14 XS1.A30 XS1.B30 XS2.A6 XS2.A7 XS2.A14 XS2.A30 XS2.B30
VCC12: C93.1 J9.0
VCC12S: C94.1 J9.1 XS1.B29 XS2.B29
A0: XS1.A9 XS2.A9
A1: XS1.A10 XS2.A10
A2: XS1.A11 XS2.A11
A3: XS1.A12 XS2.A12
A4: XS1.A24 XS2.A24
A5: XS1.A23 XS2.A23
A6: XS1.A22 XS2.A22
A7: XS1.A21 XS2.A21
A8: XS1.B26 XS2.B26
A9: XS1.A27 XS2.A27
A10: XS1.B27 XS2.B27
A11: XS1.A28 XS2.A28
A12: XS1.A2 XS2.A2
A13: XS1.B2 XS2.B2
A14: XS1.A1 XS2.A1
A15: XS1.B1 XS2.B1
~{BUSA}: XS1.A26 XS2.A26 ; port Z80BUS.~{BUSACK}
~{BUSR}: XS1.A19 XS2.A19 ; port Z80BUS.~{BUSRQ}
~{CSROM}: R71.2 XS1.A25 XS2.A25 ; port ~{CSROM}
D0: XS1.B6 XS2.B6
D1: XS1.B7 XS2.B7
D2: XS1.B8 XS2.B8
D3: XS1.B11 XS2.B11
D4: XS1.B12 XS2.B12
D5: XS1.B10 XS2.B10
D6: XS1.B9 XS2.B9
D7: XS1.B3 XS2.B3
~{DOS}: XS1.A4 XS2.A4 ; port ~{DOS}
~{HALT}: XS1.B15 XS2.B15 ; port Z80BUS.~{HALT}
~{INT}: XS1.B13 XS2.B13 ; port Z80BUS.~{INT}
~{IORQ1}: XS1.B17 ; port ~{IORQ1}
~{IORQ2}: XS1.B31 XS2.B17 ; port ~{IORQ2}
IORQGE1: R69.2 XS1.A13 ; port IORQGE1
IORQGE2: R70.2 XS1.A31 XS2.A13 ; port IORQGE2
~{M1}: XS1.B24 XS2.B24 ; port Z80BUS.~{M1}
~{MREQ}: XS1.B16 XS2.B16 ; port Z80BUS.~{MREQ}
~{NMI}: XS1.B14 XS2.B14 ; port Z80BUS.~{NMI}
~{RD}: XS1.B18 XS2.B18 ; port Z80BUS.~{RD}
~{RDROM}: R71.1 XS1.A15 XS2.A15 ; port ~{RDROM}
~{RES}: XS1.A20 XS2.A20 ; port ~{RES}
~{RFSH}: XS1.B25 XS2.B25 ; port Z80BUS.~{RFSH}
RS: XS1.A16 XS2.A16 ; port RS
~{WAIT}: XS1.B21 XS2.B21 ; port Z80BUS.~{WAIT}
~{WR}: XS1.B19 XS2.B19 ; port Z80BUS.~{WR}

Not connected (* = marked no-connect by the designer): XS1 A5 A8 A17 A18 B4 B5 B20 B22 B23; XS2 A5 A8 A17 A18 A31 B4 B5 B20 B22 B23 B31

### Buses and harness runs
bus A[0..15]
bus D[0..7]

### Notes on the sheet
- (in symbol ZXSLOT, part A) +5V; D\C\D\O\S\; 14MHz(K); GND; RAS; A0; I\O\R\Q\C\E\; GND(K); C\S\R\O\M\C\E\; RS(K); B\U\S\R\Q\; R\E\S\; C\S\R\O\M\; B\U\S\A\K\; +5V(K); nc
- (in symbol ZXSLOT, part B) D7; C\S\D\S\; TURBO(K); D0; D1; D2; D6; D5; D3; D4; I\N\T\; N\M\I\; H\A\L\T\; M\R\E\Q\; I\O\R\Q\; R\D\; W\R\; W\A\I\T\; M\1\; R\F\S\H\; +5V(K); +12V(K); GND; nc

### Library data of the parts
C89 C90 = EC1210-22uF: Standard Tantalum, 22 uF, +/- 10%, 16 V, -55 to 125 degC, 2-Pin SMD (1210), RoHS, Tape and Reel; Manufacturer: Kyocera AVX; Manufacturer Part Number: TAJB226K016RNJ; value: 22uF; Number of Pins: 2; Termination: SMD/SMT; Case/Package: 1210; Category: Cap
C91-C94 = CC0805: as C33 on sheet TOP; value: 1.5pF; Category: Cap; Case/Package: 0805
J9 = JUMPER: HLT->~IP; Value: PLS-2; Case/Package: PLS-2; Category: Connector
R69-R71 = CR0805: as R17 on sheet TOP; Category: Res; Case/Package: 0805; Number of Terminations: 2; Termination: SMD/SMT; Number of Pins: 2
XS1 XS2 = ZXSLOT: Value: ZXSLOT; Case/Package: SL62; Category: Connector

## Sheet FDC.SchDoc
size A3; SheetNumber: 5; SheetTotal: 15
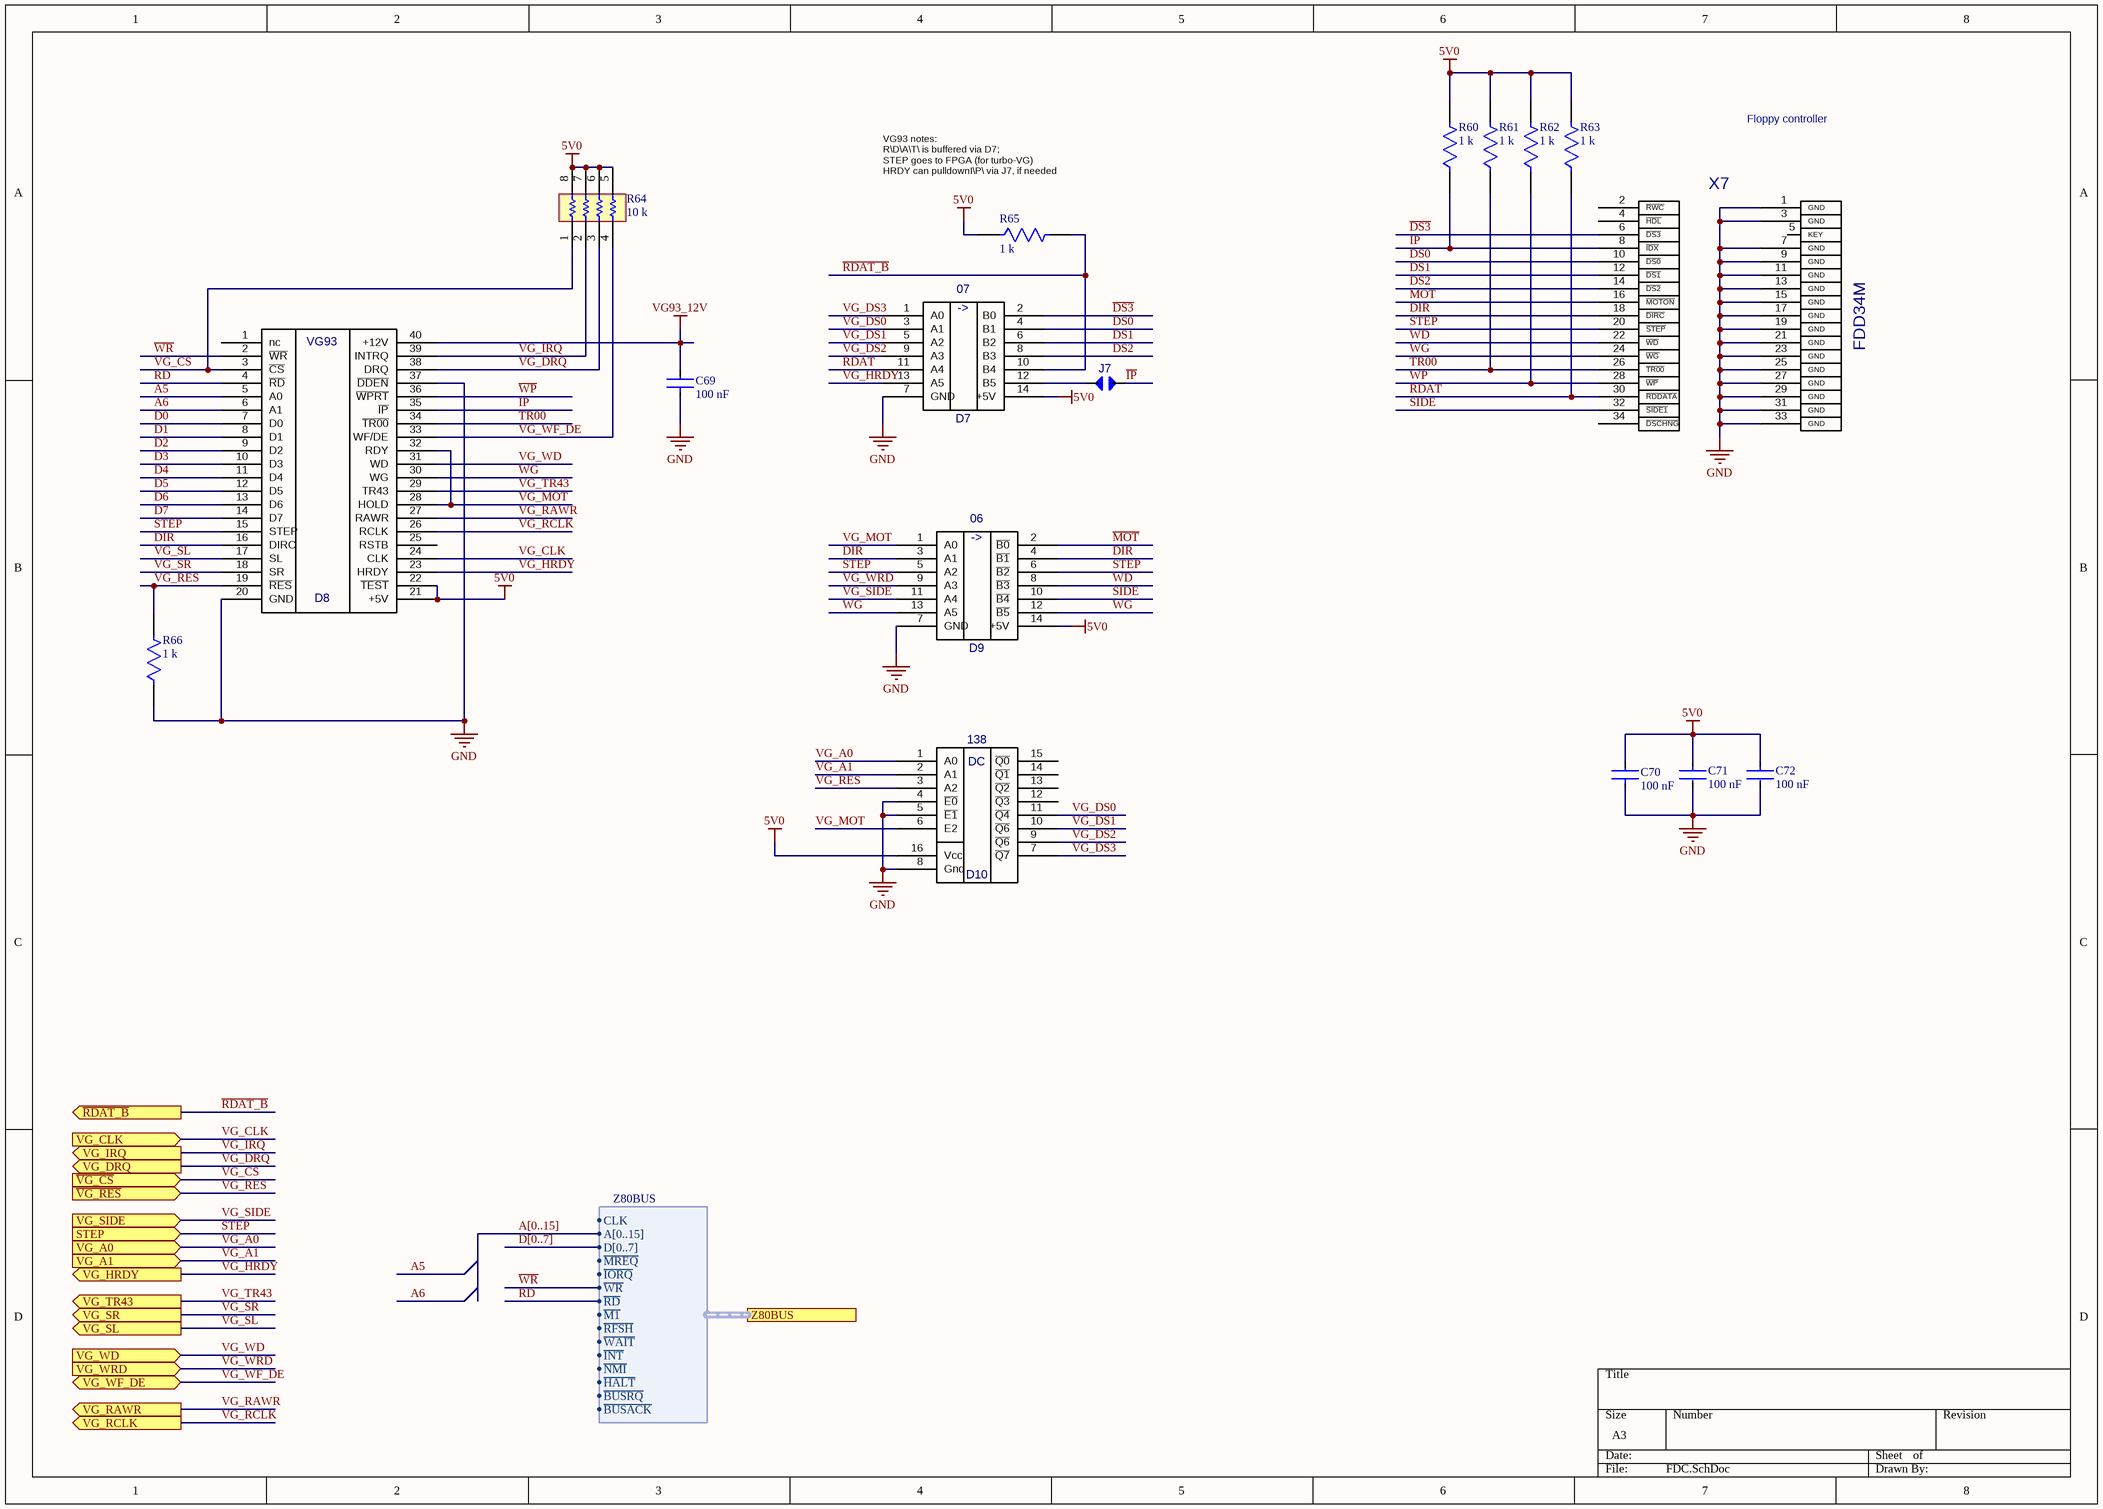
[diagram p6: FDC.SchDoc]

### Parts
C69  Capacitance: 100 nF  [CC0805]  (hidden comment: CC0805-1.5pF)
C70  Capacitance: 100 nF  [CC0805]  (hidden comment: CC0805-1.5pF)
C71  Capacitance: 100 nF  [CC0805]  (hidden comment: CC0805-1.5pF)
C72  Capacitance: 100 nF  [CC0805]  (hidden comment: CC0805-1.5pF)
D7  07  [SO14]
D8  KR1818VG93  [DIP40]  (value not drawn)
D9  06  [SO14]
D10  138  [SO16]
J7  JUMPER  [JUMPER_JUMPER(Primary)]  (value not drawn)
R60  Resistance: 1 k  [CR0805]  (hidden comment: CR0805-51)
R61  Resistance: 1 k  [CR0805]  (hidden comment: CR0805-51)
R62  Resistance: 1 k  [CR0805]  (hidden comment: CR0805-51)
R63  Resistance: 1 k  [CR0805]  (hidden comment: CR0805-51)
R64  Resistance: 10 k  [BOUR-CAY16-J4_V]  (hidden comment: CAY16-103J4LF)
R65  Resistance: 1 k  [CR0805]  (hidden comment: CR0805-51)
R66  Resistance: 1 k  [CR0805]  (hidden comment: CR0805-51)
X7  FDD34M  [FDD34M]

### Ports
STEP (in), VG_A0 (in), VG_A1 (in), VG_CLK (in), VG_DRQ (out), VG_HRDY (out), VG_IRQ (out), VG_RAWR (out), VG_RCLK (out), VG_SIDE (in), VG_SL (out), VG_SR (out), VG_TR43 (out), VG_WD (in), VG_WF_DE (bidir), VG_WRD (in), Z80BUS (harness Z80BUS), ~{RDAT_B} (out), ~{VG_CS} (in), ~{VG_RES} (in)

### Harnesses
Z80BUS: A[0..15], D[0..7], ~{MREQ}, ~{IORQ}, ~{WR}, ~{RD}, ~{M1}, ~{RFSH}, ~{WAIT}, ~{INT}, ~{NMI}, ~{HALT}, ~{BUSRQ}, ~{BUSACK}, CLK

### Nets
5V0: C70.2 C71.1 C72.1 D7.14(+5V) D8.21(+5V) D8.22(~{TEST}) D9.14(+5V) D10.16(Vcc) R60.2 R61.2 R62.2 R63.2 R64.5 R64.6 R64.7 R64.8 R65.1
GND: C69.1 C70.1 C71.2 C72.2 D7.7(GND) D8.20(GND) D8.37(~{DDEN}) D9.7(GND) D10.4(~{E0}) D10.5(~{E1}) D10.8(Gnd) R66.1 X7.1(GND) X7.3(GND) X7.7(GND) X7.9(GND) X7.11(GND) X7.13(GND) X7.15(GND) X7.17(GND) X7.19(GND) X7.21(GND) X7.23(GND) X7.25(GND) X7.27(GND) X7.29(GND) X7.31(GND) X7.33(GND)
VG93_12V: C69.2 D8.40(+12V)
A5: D8.5(A0)
A6: D8.6(A1)
D0: D8.7(D0)
D1: D8.8(D1)
D2: D8.9(D2)
D3: D8.10(D3)
D4: D8.11(D4)
D5: D8.12(D5)
D6: D8.13(D6)
D7: D8.14(D7)
~{DIR}: D9.4(~{B1}) X7.18(~{DIRC})  [project net ~{DIR}_5]
~{DS0}: D7.4(B1) X7.10(~{DS0})  [project net ~{DS0}_5]
~{DS1}: D7.6(B2) X7.12(~{DS1})  [project net ~{DS1}_5]
~{DS2}: D7.8(B3) X7.14(~{DS2})  [project net ~{DS2}_5]
~{DS3}: D7.2(B0) X7.6(~{DS3})  [project net ~{DS3}_5]
DIR: D8.16(DIRC) D9.3(A1)  [project net DIR_5]
~{IP}: D8.35(~{IP}) J7.1 R60.1 X7.8(~{IDX})  [project net ~{IP}_5]
~{MOT}: D9.2(~{B0}) X7.16(~{MOTON})  [project net ~{MOT}_5]
~{RD}: D8.4(~{RD}) ; port Z80BUS.~{RD}
~{RDAT}: D7.11(A4) R63.1 X7.30(~{RDDATA})  [project net ~{RDAT}_5]
~{RDAT_B}: D7.10(B4) R65.2 ; port ~{RDAT_B}
~{SIDE}: D9.10(~{B4}) X7.32(~{SIDE1})  [project net ~{SIDE}_5]
~{STEP}: D9.6(~{B2}) X7.20(~{STEP})  [project net ~{STEP}_5]
STEP: D8.15(STEP) D9.5(A2) ; port STEP
~{TR00}: D8.34(~{TR00}) R61.1 X7.26(~{TR00})  [project net ~{TR00}_5]
~{VG_CS}: D8.3(~{CS}) R64.1 ; port ~{VG_CS}
~{VG_RES}: D8.19(~{RES}) D10.3(A2) R66.2 ; port ~{VG_RES}
VG_A0: D10.1(A0) ; port VG_A0
VG_A1: D10.2(A1) ; port VG_A1
VG_CLK: D8.24(CLK) ; port VG_CLK
VG_DRQ: D8.38(DRQ) R64.3 ; port VG_DRQ
VG_DS0: D7.3(A1) D10.11(~{Q4})  [project net VG_DS0_5]
VG_DS1: D7.5(A2) D10.10(~{Q6})  [project net VG_DS1_5]
VG_DS2: D7.9(A3) D10.9(~{Q6})  [project net VG_DS2_5]
VG_DS3: D7.1(A0) D10.7(~{Q7})  [project net VG_DS3_5]
VG_HRDY: D7.13(A5) D8.23(HRDY) ; port VG_HRDY
VG_IRQ: D8.39(INTRQ) R64.2 ; port VG_IRQ
VG_MOT: D8.28(HOLD) D8.32(RDY) D9.1(A0) D10.6(E2)  [project net VG_MOT_5]
VG_RAWR: D8.27(RAWR) ; port VG_RAWR
VG_RCLK: D8.26(RCLK) ; port VG_RCLK
VG_SIDE: D9.11(A4) ; port VG_SIDE
VG_SL: D8.17(SL) ; port VG_SL
VG_SR: D8.18(SR) ; port VG_SR
VG_TR43: D8.29(TR43) ; port VG_TR43
VG_WD: D8.31(WD) ; port VG_WD
VG_WF_DE: D8.33(WF/DE) R64.4 ; port VG_WF_DE
VG_WRD: D9.9(A3) ; port VG_WRD
~{WD}: D9.8(~{B3}) X7.22(~{WD})  [project net ~{WD}_5]
~{WG}: D9.12(~{B5}) X7.24(~{WG})  [project net ~{WG}_5]
~{WP}: D8.36(~{WPRT}) R62.1 X7.28(~{WP})  [project net ~{WP}_5]
~{WR}: D8.2(~{WR}) ; port Z80BUS.~{WR}
WG: D8.30(WG) D9.13(A5)  [project net WG_5]
NetD7_12: D7.12(B5) J7.0

Not connected (* = marked no-connect by the designer): D8 1(nc) 25(RSTB); D10 12(~{Q3}) 13(~{Q2}) 14(~{Q1}) 15(~{Q0}); X7 2(~{RWC}) 4(~{HDL}) 5(KEY) 34(~{DSCHNG})

### Buses and harness runs
bus A[0..15]
bus D[0..7]

### Notes on the sheet
- Floppy controller
- (near R65) VG93 notes:
  R\D\A\T\ is buffered via D7;
  STEP goes to FPGA (for turbo-VG)
  HRDY can pulldownI\P\ via J7, if needed
- (in symbol 06) ->
- (in symbol 07) ->
- (in symbol 138) DC
- (in symbol KR1818VG93) VG93

### Library data of the parts
C69-C72 = CC0805: as C33 on sheet TOP; value: 1.5pF; Category: Cap; Case/Package: 0805
D7 = 07: Value: 74HCT07; Case/Package: SOIC-14; Category: IC
D9 = 06: Value: 74HCT06; Case/Package: SOIC-14; Category: IC
D10 = 138: value: 74HCT138; Case/Package: SOIC-16; Category: IC
J7 = JUMPER: HLT->~IP; Value: PLS-2; Case/Package: PLS-2; Category: Connector
R60-R63 R65 R66 = CR0805: as R8 on sheet TOP; Case/Package: 0805; Number of Pins: 2; Termination: SMD/SMT; value: 51Ω; Category: Res; Number of Terminations: 2
R64 = CMP-1747-00005-1: as R72 on sheet CPU ROM; Packaging: Tape and Reel; Min Operating Temperature: -55 degC; Pins: 2; Radiation Hardening: No; DatasheetVersion: Jan-15; Length: 0.063 inch; RoHSCompliant: true; Mount: Surface Mount; ComponentLink1Description: Manufacturer URL; ComponentLink1URL: http://www.bourns.com/; Weight: 7.1E-05 oz; ComponentLink2URL: http://www.bourns.com/docs/Product-Datasheets/CATCAY.pdf; PackageReference: CAY16-J4; Width: 0.031 inch; Case Code (Imperial): 0603; Case Code (Metric): 1608; REACH SVHC: Yes; Max Operating Temperature: 155 degC; ComponentLink2Description: Datasheet; Height: 0.022 inch; PackageDescription: 8-Pin Surface Mount Device, Body 1.6 x 3.2 mm, Pitch 0.8 mm
X7 = FDD34M: Value: Shrouded Header 34 pos 2.54mm 2 row; Case/Package: IDC-34; Category: Connector
D8 = KR1818VG93: Value: KR1818VG93; Case/Package: DIP-40; Category: IC

## Sheet CPLD.SchDoc
size A3; SheetNumber: 13; SheetTotal: 16
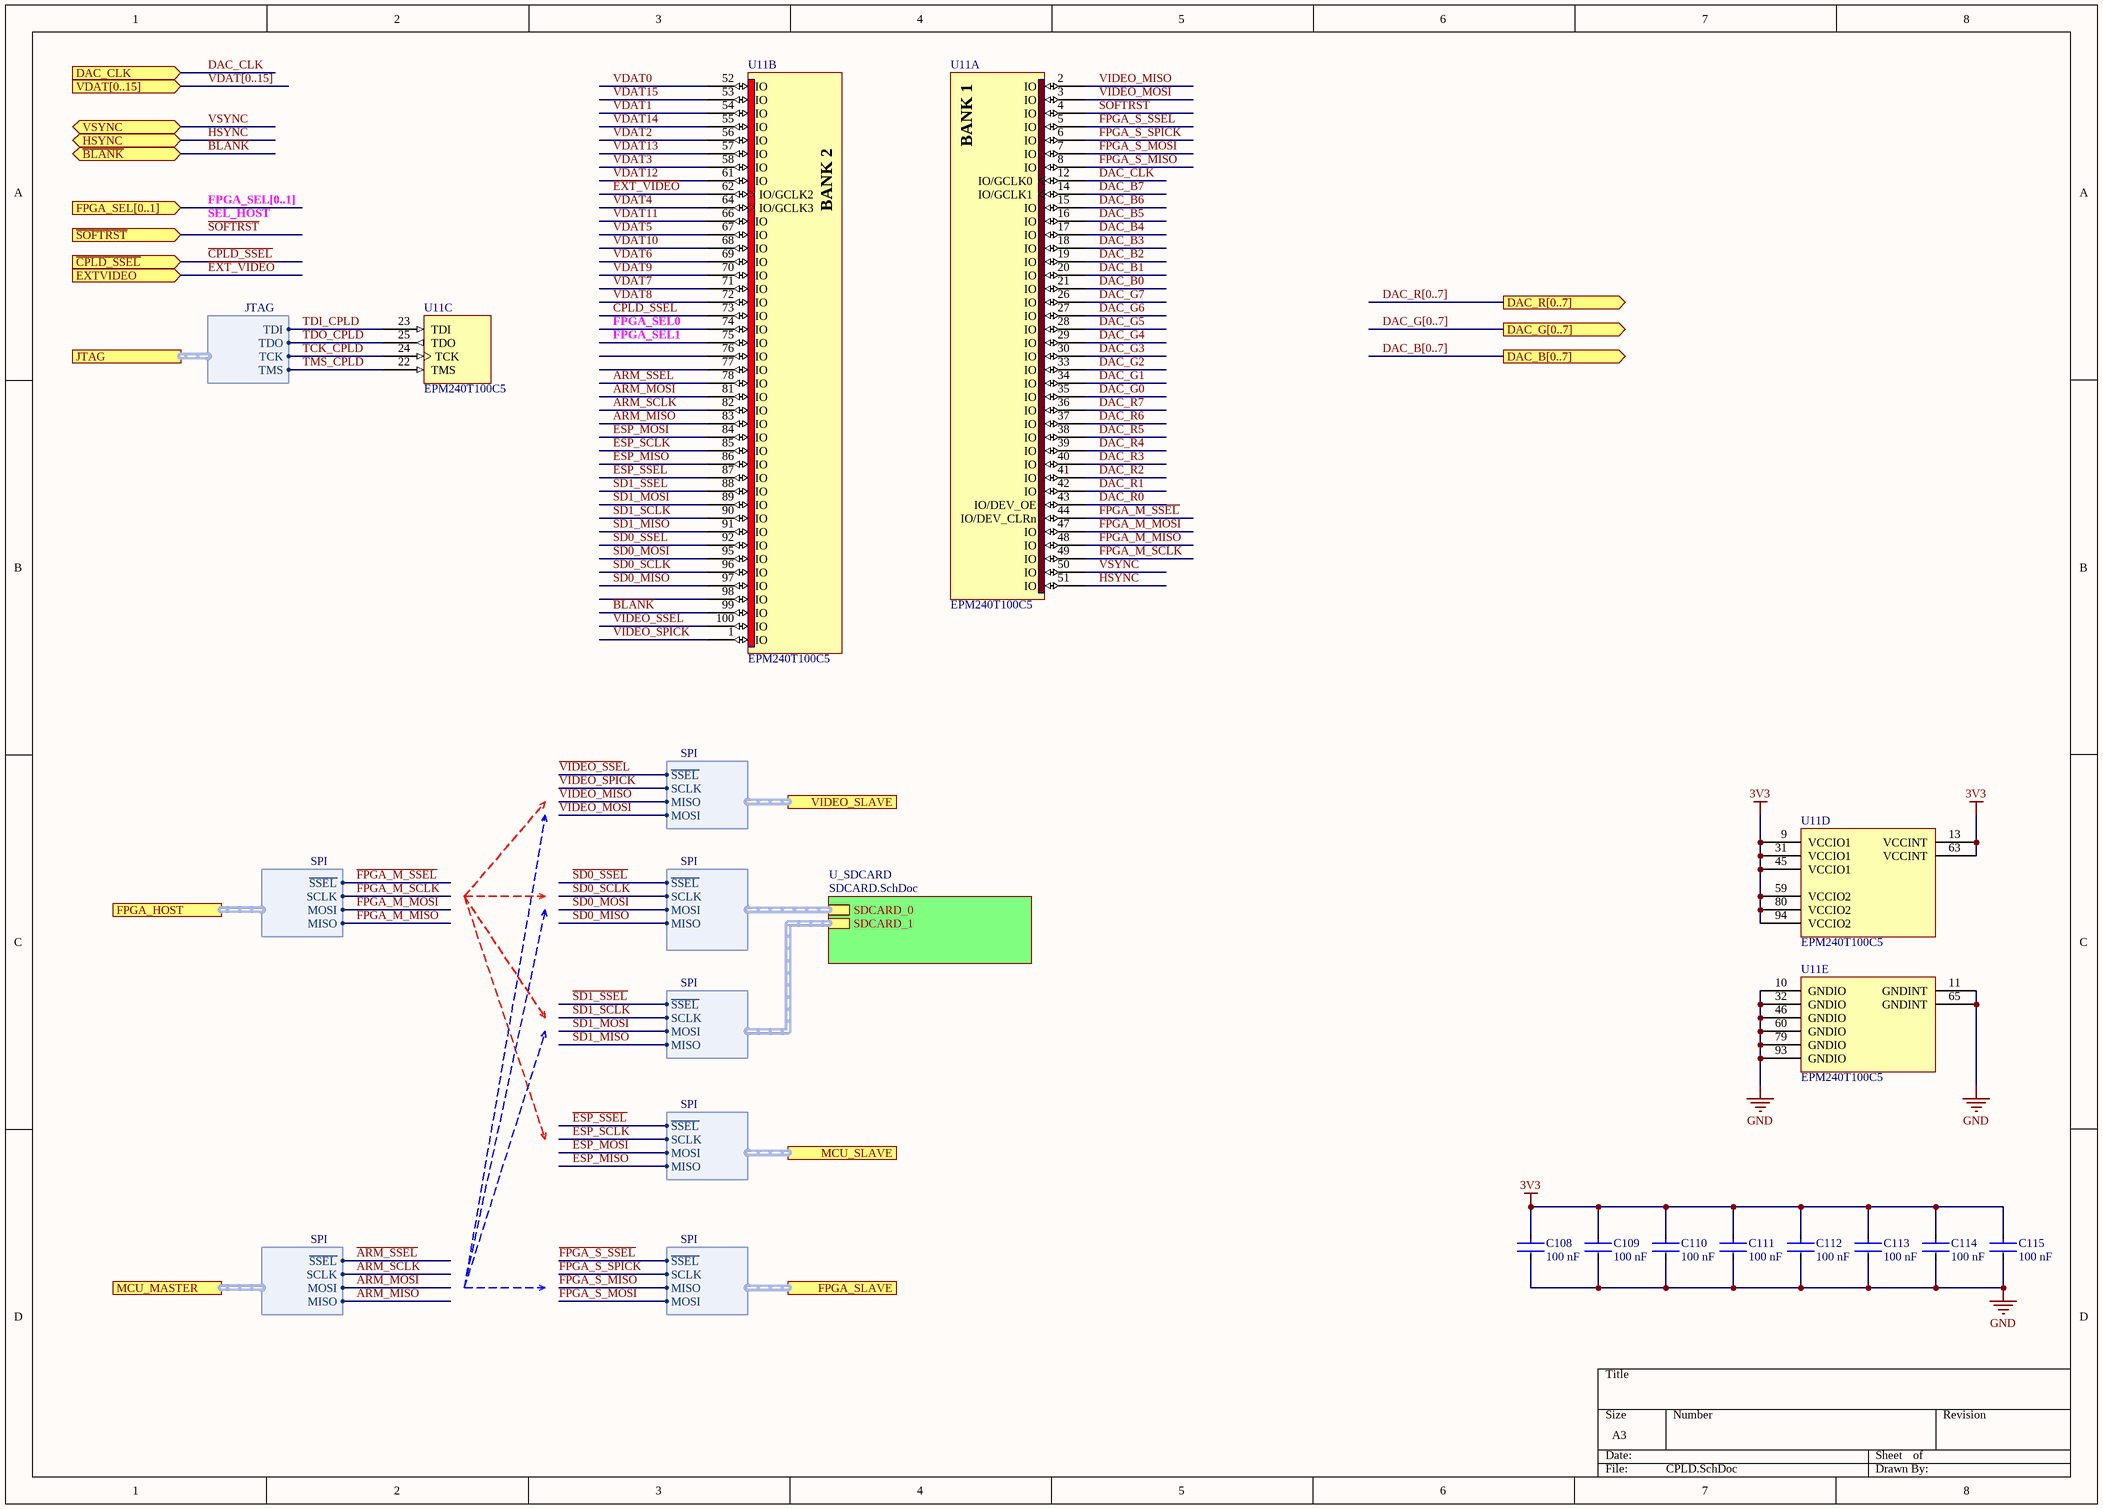
[diagram p7: CPLD.SchDoc]

### Parts
C108  Capacitance: 100 nF  [CC0805]  (hidden comment: CC0805-1.5pF)
C109  Capacitance: 100 nF  [CC0805]  (hidden comment: CC0805-1.5pF)
C110  Capacitance: 100 nF  [CC0805]  (hidden comment: CC0805-1.5pF)
C111  Capacitance: 100 nF  [CC0805]  (hidden comment: CC0805-1.5pF)
C112  Capacitance: 100 nF  [CC0805]  (hidden comment: CC0805-1.5pF)
C113  Capacitance: 100 nF  [CC0805]  (hidden comment: CC0805-1.5pF)
C114  Capacitance: 100 nF  [CC0805]  (hidden comment: CC0805-1.5pF)
C115  Capacitance: 100 nF  [CC0805]  (hidden comment: CC0805-1.5pF)
U11  EPM240T100C5  [TQFP100_M]  (parts A,B,C,D,E of 5)

### Sub-sheets
U_SDCARD = SDCARD.SchDoc: SDCARD_0 (harness SPI), SDCARD_1 (harness SPI)

### Ports
DAC_B[0..7] (out), DAC_CLK (in), DAC_G[0..7] (out), DAC_R[0..7] (out), EXTVIDEO (in), FPGA_HOST (harness SPI), FPGA_SEL[0..1] (in), FPGA_SLAVE (harness SPI), HSYNC (bidir), JTAG (harness JTAG), MCU_MASTER (harness SPI), MCU_SLAVE (harness SPI), VDAT[0..15] (in), VIDEO_SLAVE (harness SPI), VSYNC (bidir), ~{BLANK} (bidir), ~{CPLD_SSEL} (in), ~{SOFTRST} (in)

### Harnesses
SPI: ~{SSEL}, SCLK, MOSI, MISO
JTAG: TCK, TDO, TDI, TMS

### Nets
3V3: C108.1 C109.1 C110.1 C111.1 C112.1 C113.1 C114.1 C115.1 U11.9(VCCIO1) U11.13(VCCINT) U11.31(VCCIO1) U11.45(VCCIO1) U11.59(VCCIO2) U11.63(VCCINT) U11.80(VCCIO2) U11.94(VCCIO2)
GND: C108.2 C109.2 C110.2 C111.2 C112.2 C113.2 C114.2 C115.2 U11.10(GNDIO) U11.11(GNDINT) U11.32(GNDIO) U11.46(GNDIO) U11.60(GNDIO) U11.65(GNDINT) U11.79(GNDIO) U11.93(GNDIO)
~{ARM_SSEL}: U11.78(IO) ; port MCU_MASTER.~{SSEL}  [project net ESP32_MASTER.~{SSEL}]
ARM_MISO: U11.83(IO) ; port MCU_MASTER.MISO  [project net ESP32_MASTER.MISO]
ARM_MOSI: U11.81(IO) ; port MCU_MASTER.MOSI  [project net ESP32_MASTER.MOSI]
ARM_SCLK: U11.82(IO) ; port MCU_MASTER.SCLK  [project net ESP32_MASTER.SCLK]
~{BLANK}: U11.99(IO) ; port ~{BLANK}
~{CPLD_SSEL}: U11.73(IO) ; port ~{CPLD_SSEL}
DAC_B0: U11.21(IO)
DAC_B1: U11.20(IO)
DAC_B2: U11.19(IO)
DAC_B3: U11.18(IO)
DAC_B4: U11.17(IO)
DAC_B5: U11.16(IO)
DAC_B6: U11.15(IO)
DAC_B7: U11.14(IO/GCLK1)
DAC_CLK: U11.12(IO/GCLK0) ; port DAC_CLK
DAC_G0: U11.35(IO)
DAC_G1: U11.34(IO)
DAC_G2: U11.33(IO)
DAC_G3: U11.30(IO)
DAC_G4: U11.29(IO)
DAC_G5: U11.28(IO)
DAC_G6: U11.27(IO)
DAC_G7: U11.26(IO)
DAC_R0: U11.43(IO/DEV_OE)
DAC_R1: U11.42(IO)
DAC_R2: U11.41(IO)
DAC_R3: U11.40(IO)
DAC_R4: U11.39(IO)
DAC_R5: U11.38(IO)
DAC_R6: U11.37(IO)
DAC_R7: U11.36(IO)
~{ESP_SSEL}: U11.87(IO) ; port MCU_SLAVE.~{SSEL}  [project net ESP32_SLAVE.~{SSEL}]
~{EXT_VIDEO}: U11.62(IO/GCLK2) ; port EXTVIDEO
ESP_MISO: U11.86(IO) ; port MCU_SLAVE.MISO  [project net ESP32_SLAVE.MISO]
ESP_MOSI: U11.84(IO) ; port MCU_SLAVE.MOSI  [project net ESP32_SLAVE.MOSI]
ESP_SCLK: U11.85(IO) ; port MCU_SLAVE.SCLK  [project net ESP32_SLAVE.SCLK]
~{FPGA_M_}~{SSEL}: U11.44(IO/DEV_CLRn) ; port FPGA_HOST.~{SSEL}  [project net SPI_HOST.~{SSEL}]
~{FPGA_S_SSEL}: U11.5(IO) ; port FPGA_SLAVE.~{SSEL}  [project net ~{SPI_SLAVE_SSEL}]
FPGA_M_MISO: U11.48(IO) ; port FPGA_HOST.MISO  [project net SPI_HOST.MISO]
FPGA_M_MOSI: U11.47(IO) ; port FPGA_HOST.MOSI  [project net SPI_HOST.MOSI]
FPGA_M_SCLK: U11.49(IO) ; port FPGA_HOST.SCLK  [project net SPI_HOST.SCLK]
FPGA_S_MISO: U11.8(IO) ; port FPGA_SLAVE.MISO  [project net SPI_SLAVE.MISO]
FPGA_S_MOSI: U11.7(IO) ; port FPGA_SLAVE.MOSI  [project net SPI_SLAVE.MOSI]
FPGA_S_SPICK: U11.6(IO) ; port FPGA_SLAVE.SCLK  [project net SPI_SLAVE.SCLK]
FPGA_SEL0: U11.74(IO)
FPGA_SEL1: U11.75(IO)
HSYNC: U11.51(IO) ; port HSYNC
~{SD0_SSEL}: U11.92(IO) ; sheet U_SDCARD/SDCARD_0.~{SSEL}
~{SD1_SSEL}: U11.88(IO) ; sheet U_SDCARD/SDCARD_1.~{SSEL}
~{SOFTRST}: U11.4(IO) ; port ~{SOFTRST}
SD0_MISO: U11.97(IO) ; sheet U_SDCARD/SDCARD_0.MISO
SD0_MOSI: U11.95(IO) ; sheet U_SDCARD/SDCARD_0.MOSI
SD0_SCLK: U11.96(IO) ; sheet U_SDCARD/SDCARD_0.SCLK
SD1_MISO: U11.91(IO) ; sheet U_SDCARD/SDCARD_1.MISO
SD1_MOSI: U11.89(IO) ; sheet U_SDCARD/SDCARD_1.MOSI
SD1_SCLK: U11.90(IO) ; sheet U_SDCARD/SDCARD_1.SCLK
TCK_CPLD: U11.24(TCK) ; port JTAG.TCK  [project net TCK_FPGA]
TDI_CPLD: U11.23(TDI) ; port JTAG.TDI  [project net TDO_FPGA]
TDO_CPLD: U11.25(TDO) ; port JTAG.TDO
TMS_CPLD: U11.22(TMS) ; port JTAG.TMS  [project net TMS_FPGA]
~{VIDEO_SSE}L: U11.100(IO) ; port VIDEO_SLAVE.~{SSEL}  [project net SPI_EXT.~{SSEL}]
VDAT0: U11.52(IO)
VDAT1: U11.54(IO)
VDAT2: U11.56(IO)
VDAT3: U11.58(IO)
VDAT4: U11.64(IO/GCLK3)
VDAT5: U11.67(IO)
VDAT6: U11.69(IO)
VDAT7: U11.71(IO)
VDAT8: U11.72(IO)
VDAT9: U11.70(IO)
VDAT10: U11.68(IO)
VDAT11: U11.66(IO)
VDAT12: U11.61(IO)
VDAT13: U11.57(IO)
VDAT14: U11.55(IO)
VDAT15: U11.53(IO)
VIDEO_MISO: U11.2(IO) ; port VIDEO_SLAVE.MISO  [project net MISO]
VIDEO_MOSI: U11.3(IO) ; port VIDEO_SLAVE.MOSI  [project net MOSI]
VIDEO_SPICK: U11.1(IO) ; port VIDEO_SLAVE.SCLK  [project net SCLK]
VSYNC: U11.50(IO) ; port VSYNC

Not connected (* = marked no-connect by the designer): U11 76(IO) 77(IO) 98(IO)

### Buses and harness runs
bus DAC_B[0..7] = port DAC_B[0..7]
bus DAC_G[0..7] = port DAC_G[0..7]
bus DAC_R[0..7] = port DAC_R[0..7]
bus FPGA_SEL[0..1] = port FPGA_SEL[0..1]
bus VDAT[0..15] = port VDAT[0..15]

### Notes on the sheet
- Labels drawn without touching a wire or pin: SEL_HOST
- (in symbol EPM240T100C5, part A) BANK 1
- (in symbol EPM240T100C5, part B) BANK 2

### Library data of the parts
C108-C115 = CC0805: as C33 on sheet TOP; Category: Cap; value: 1.5pF; Case/Package: 0805
U11 = EPM240T100C5: MAX II 3.3/2.5V CPLD, 80 IOs, 240 Logic Elements, 100-Pin Plastic TQFP, Commercial Temperature, Speed Grade 5; Manufacturer: Intel Altera; PackageDescription: 100-Pin Plastic Thin Quad Flat Pack (TQFP100) - Wire Bond; Manufacturer Part Number: EPM240T100C5; value: EPM240T100C5; Case/Package: TQFP-100; Category: IC

## Sheet SDCARD.SchDoc
size A4; SheetNumber: 14; SheetTotal: 15
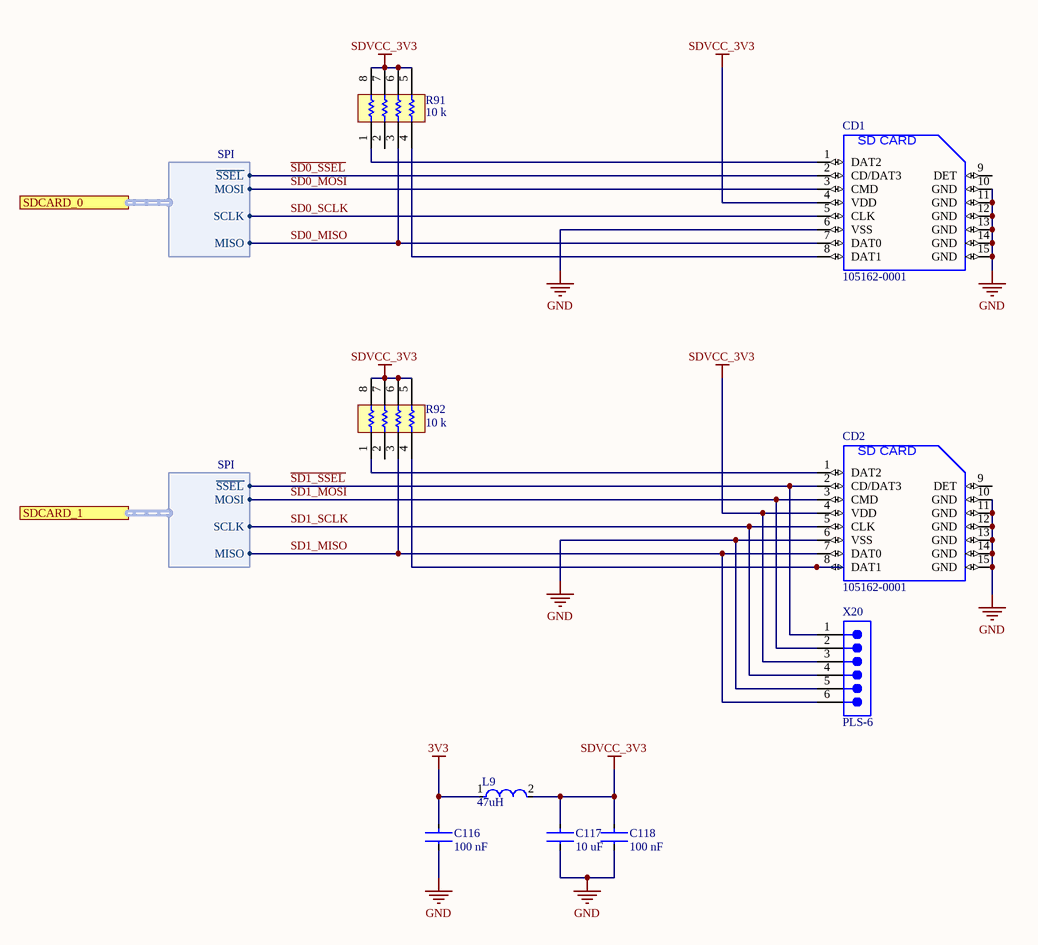
[diagram p8: SDCARD.SchDoc]

### Parts
C116  Capacitance: 100 nF  [CC0805]  (hidden comment: CC0805-1.5pF)
C117  Capacitance: 10 uF  [CC0805]  (hidden comment: CC0805-1.5pF)
C118  Capacitance: 100 nF  [CC0805]  (hidden comment: CC0805-1.5pF)
CD1  105162-0001  [105162-0001]
CD2  105162-0001  [105162-0001]
L9  Inductance: 47uH  [FP-NR6028-MFG]  (hidden comment: NR6028T470M)
R91  Resistance: 10 k  [BOUR-CAY16-J4_V]  (hidden comment: CAY16-103J4LF)
R92  Resistance: 10 k  [BOUR-CAY16-J4_V]  (hidden comment: CAY16-103J4LF)
X20  PLS-6  [SMTC-TSW-106-07-X-S]

### Ports
SDCARD_0 (harness SPI), SDCARD_1 (harness SPI)

### Harnesses
SPI: ~{SSEL}, SCLK, MOSI, MISO

### Nets
3V3: C116.1 L9.1
GND: C116.2 C117.2 C118.2 CD1.6(VSS) CD1.10(GND) CD1.11(GND) CD1.12(GND) CD1.13(GND) CD1.14(GND) CD1.15(GND) CD2.6(VSS) CD2.10(GND) CD2.11(GND) CD2.12(GND) CD2.13(GND) CD2.14(GND) CD2.15(GND) X20.5
SDVCC_3V3: C117.1 C118.1 CD1.4(VDD) CD2.4(VDD) L9.2 R91.5 R91.6 R91.7 R91.8 R92.5 R92.6 R92.7 R92.8 X20.3
~{SD0_SSEL}: CD1.2(CD/DAT3) ; port SDCARD_0.~{SSEL}
~{SD1_SSEL}: CD2.2(CD/DAT3) X20.1 ; port SDCARD_1.~{SSEL}
SD0_MISO: CD1.7(DAT0) R91.3 ; port SDCARD_0.MISO
SD0_MOSI: CD1.3(CMD) ; port SDCARD_0.MOSI
SD0_SCLK: CD1.5(CLK) ; port SDCARD_0.SCLK
SD1_MISO: CD2.7(DAT0) R92.3 X20.6 ; port SDCARD_1.MISO
SD1_MOSI: CD2.3(CMD) X20.2 ; port SDCARD_1.MOSI
SD1_SCLK: CD2.5(CLK) X20.4 ; port SDCARD_1.SCLK
NetCD1_1: CD1.1(DAT2) R91.1
NetCD1_8: CD1.8(DAT1) R91.4
NetCD2_1: CD2.1(DAT2) R92.1
NetCD2_8: CD2.8(DAT1) R92.4

Not connected (* = marked no-connect by the designer): CD1 9(DET); CD2 9(DET); R91 2; R92 2

### Notes on the sheet
- (in symbol 105162-0001) SD CARD

### Library data of the parts
C116-C118 = CC0805: as C33 on sheet TOP; Category: Cap; value: 1.5pF; Case/Package: 0805
CD1 CD2 = 105162-0001: 9 (8 + 1) Position Card Connector microSDâ„¢ Surface Mount, Right Angle Gold; MF: Molex; Value: *; Package: None; Availability: Warning; SnapEDA_Link: https://www.snapeda.com/parts/105162-0001/Molex/view-part/481895/?ref=snap; MP: 105162-0001; Mouser-Purchase-URL: https://snapeda.com/shop?store=Mouser&id=481895; Price: None
L9 = CMP-14484-001222-1: SMD Power Inductors 47uH ±20% 0.92A 0.39Ω; Current Rating: 920mA; Test Frequency: 100kHz; Core Material: Ferrite; Self Resonant Frequency: 8MHz; Shielding: Shielded; DC Resistance (DCR): 390mR; Saturation Current: 950mA; Termination: SMD/SMT; Package Quantity: 2000; RoHS Compliant: Yes; Halogen Free: Halogen Free; Length: 0.236inch; Series: NR; Tolerance: 20%; Width: 0.236inch; Height - Seated (Max): 0.11inch; Number of Pins: 2; Mount: Surface Mount; Min Operating Temperature: -25°C; RMS Current (Irms): 920mA; Packaging: Tape and Reel; Resistor Type: Wirewound; Case/Package: 2424; Inductance Tolerance: 20%; Max Operating Temperature: 120°C; Max DC Current: 920mA; Height: 2.8mm
R91 R92 = CMP-1747-00005-1: as R72 on sheet CPU ROM; Packaging: Tape and Reel; Min Operating Temperature: -55 degC; Pins: 2; Radiation Hardening: No; DatasheetVersion: Jan-15; Length: 0.063 inch; RoHSCompliant: true; Mount: Surface Mount; ComponentLink1Description: Manufacturer URL; ComponentLink1URL: http://www.bourns.com/; Weight: 7.1E-05 oz; ComponentLink2URL: http://www.bourns.com/docs/Product-Datasheets/CATCAY.pdf; PackageReference: CAY16-J4; Width: 0.031 inch; Case Code (Imperial): 0603; Case Code (Metric): 1608; REACH SVHC: Yes; Max Operating Temperature: 155 degC; ComponentLink2Description: Datasheet; Height: 0.022 inch; PackageDescription: 8-Pin Surface Mount Device, Body 1.6 x 3.2 mm, Pitch 0.8 mm
X20 = PLS-6: 0.025" SQ Post Header, Through-hole, Vertical, -55 to 125 degC, 2.54 mm Pitch, 6-Pin, Male, RoHS; Manufacturer: Samtec; PartNumber: TSW-106-07-G-S; Pitch: 2.54 mm; value: 6 pin header 2.54mm; PackageDescription: .025[0.64] SQ. Post Terminal Strip Assembly; Manufacturer Part Number: TSW-106-07-G-S; Case/Package: PLS-6; Category: Connector